# EAGLE schematic CHM‑T36VA (EAGLE 9.5.2)
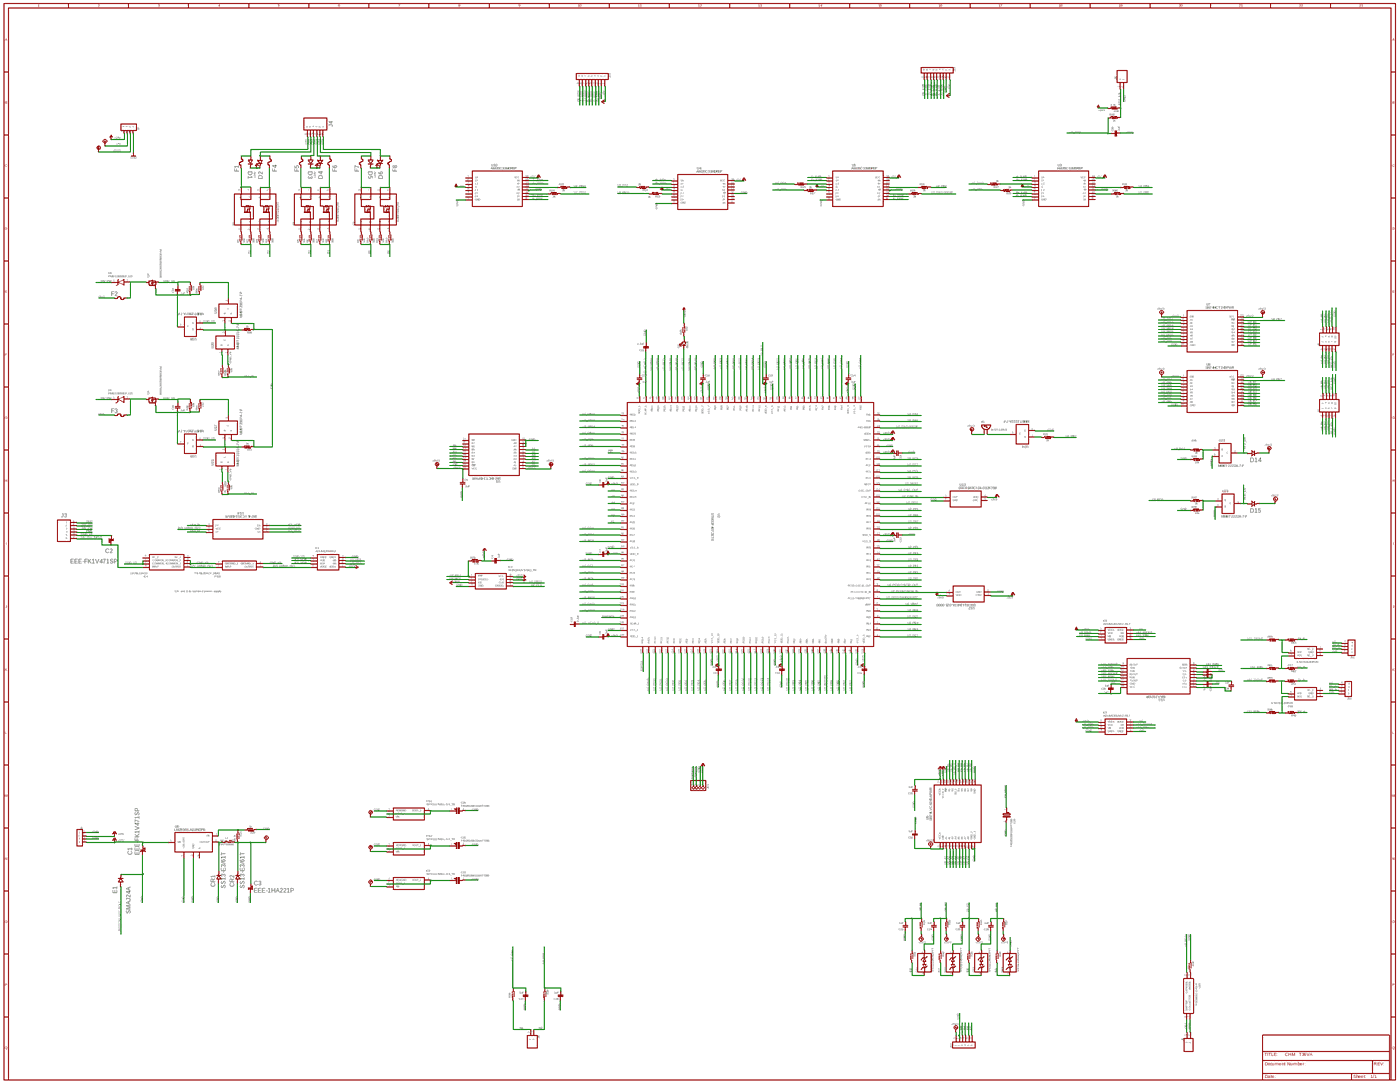
[diagram p0: schematic, sheet 1, overview]
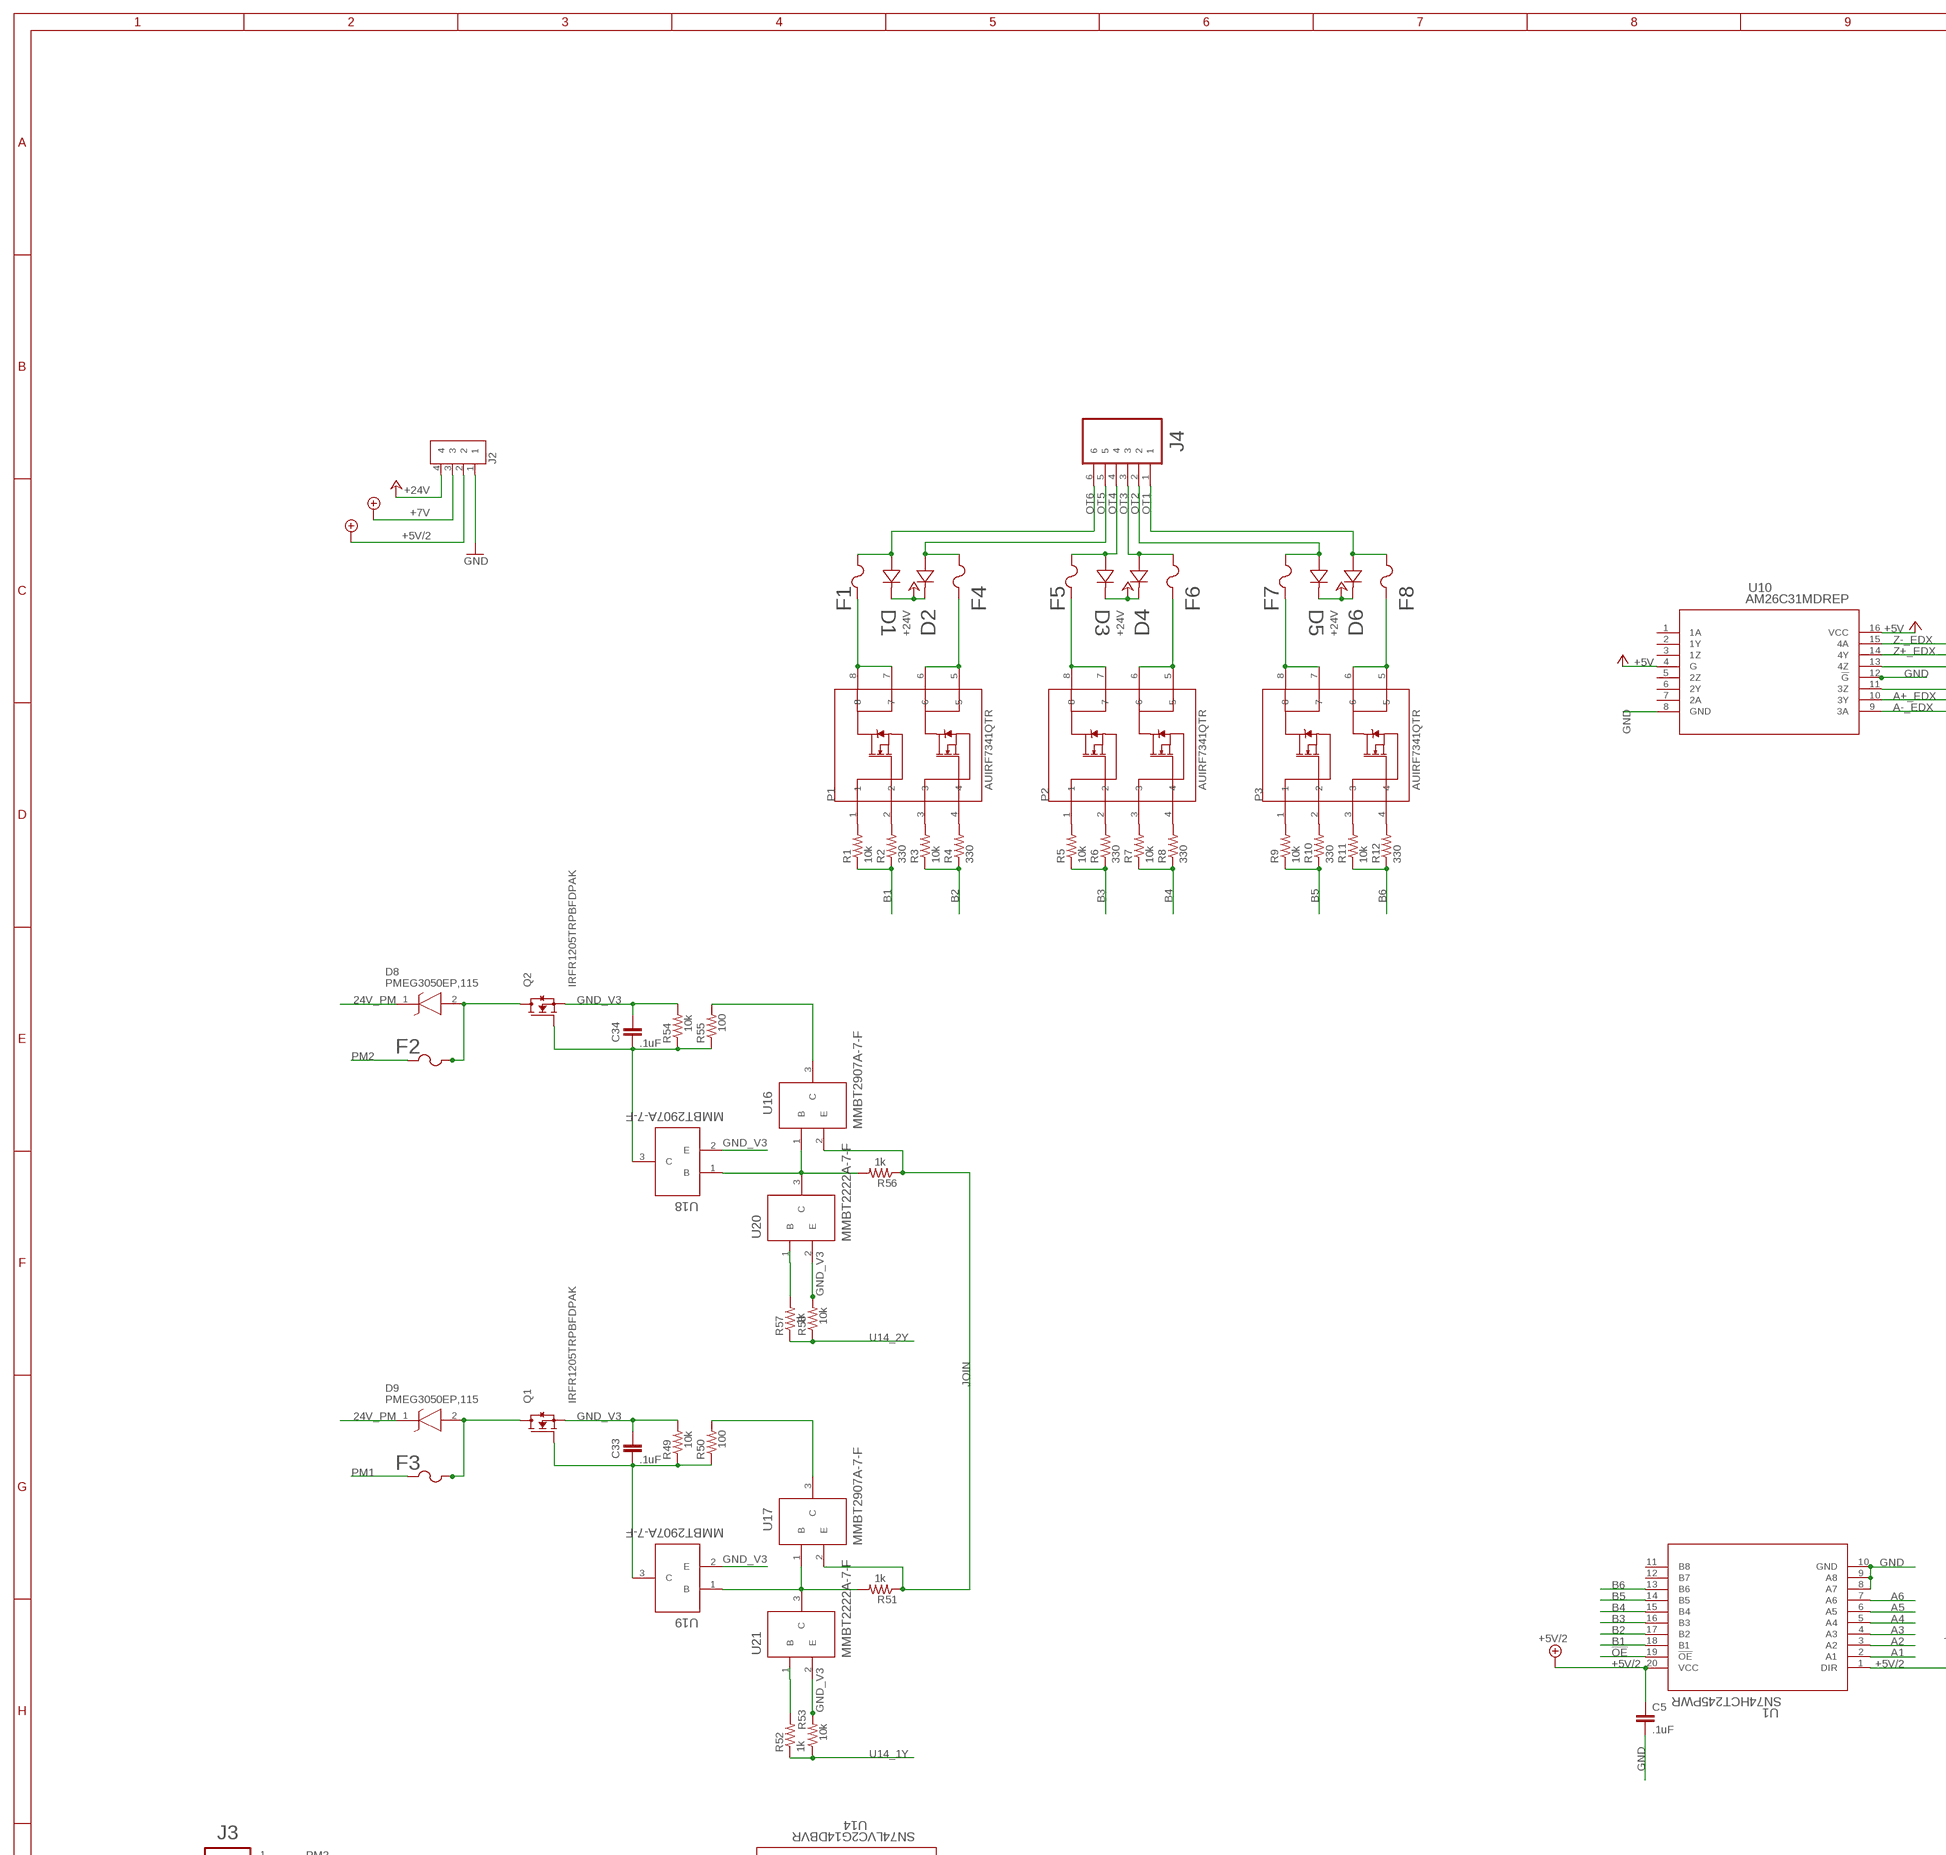
[diagram p1: schematic, sheet 1, part 1 of 6]
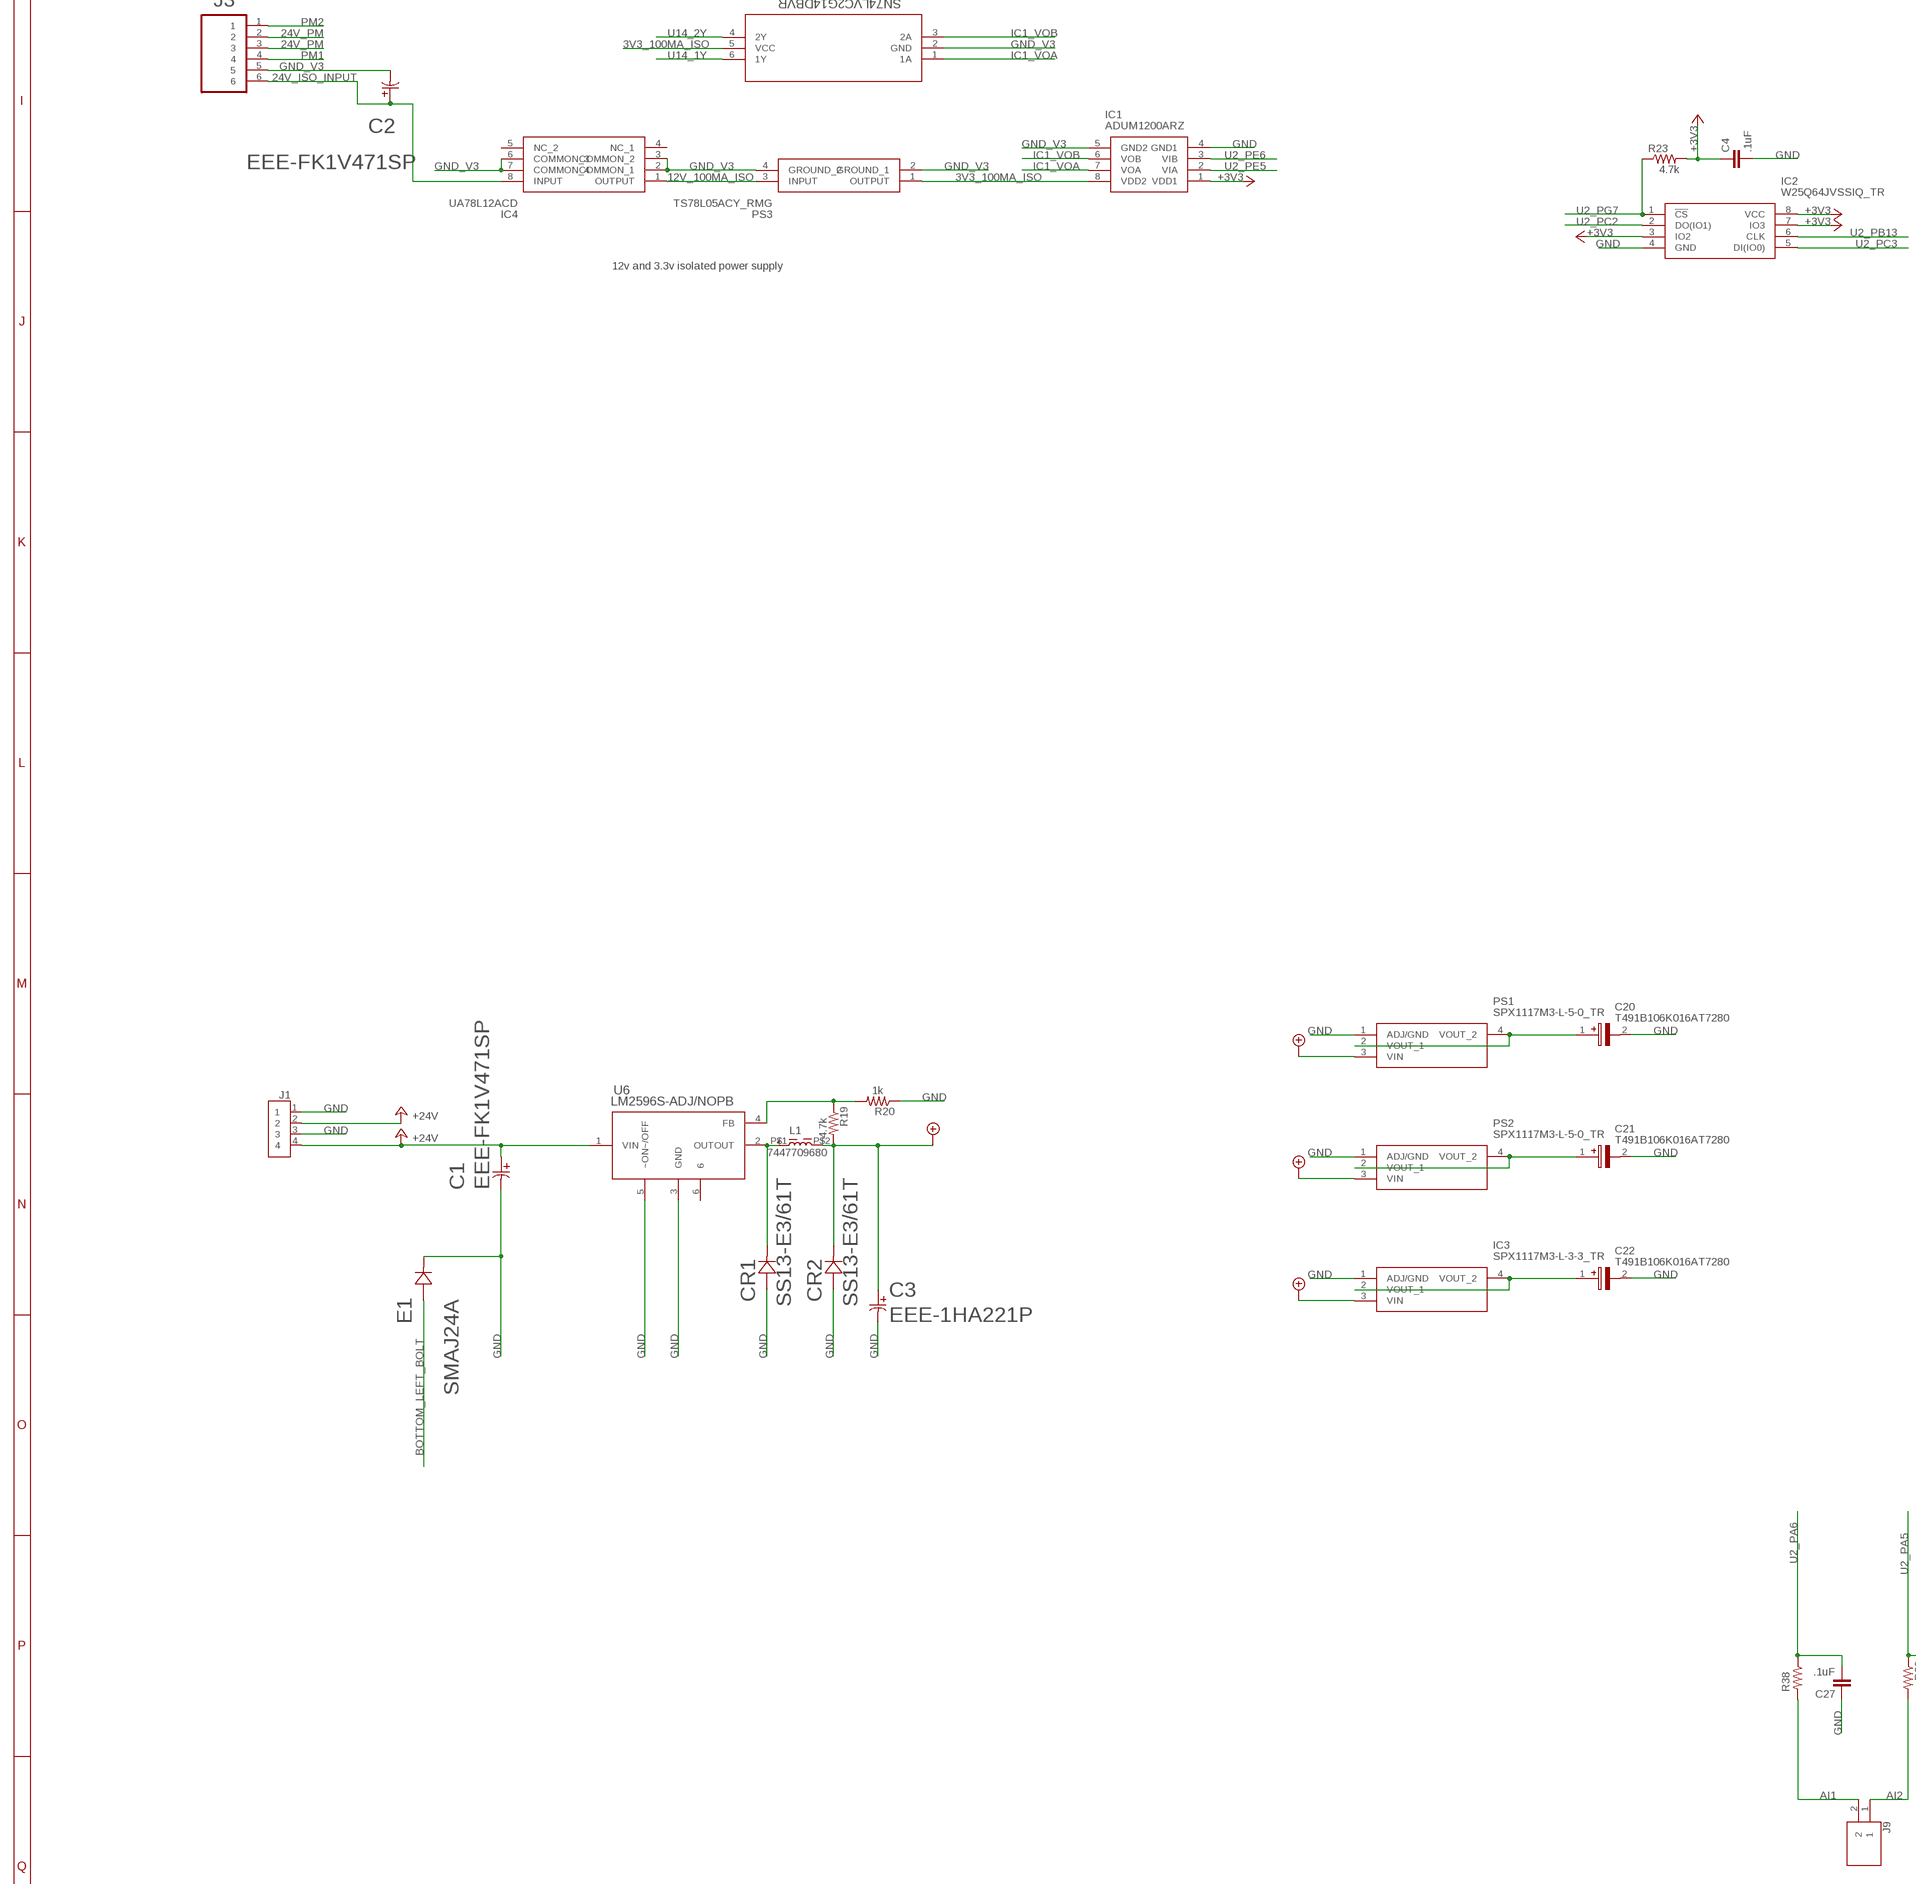
[diagram p2: schematic, sheet 1, part 2 of 6]
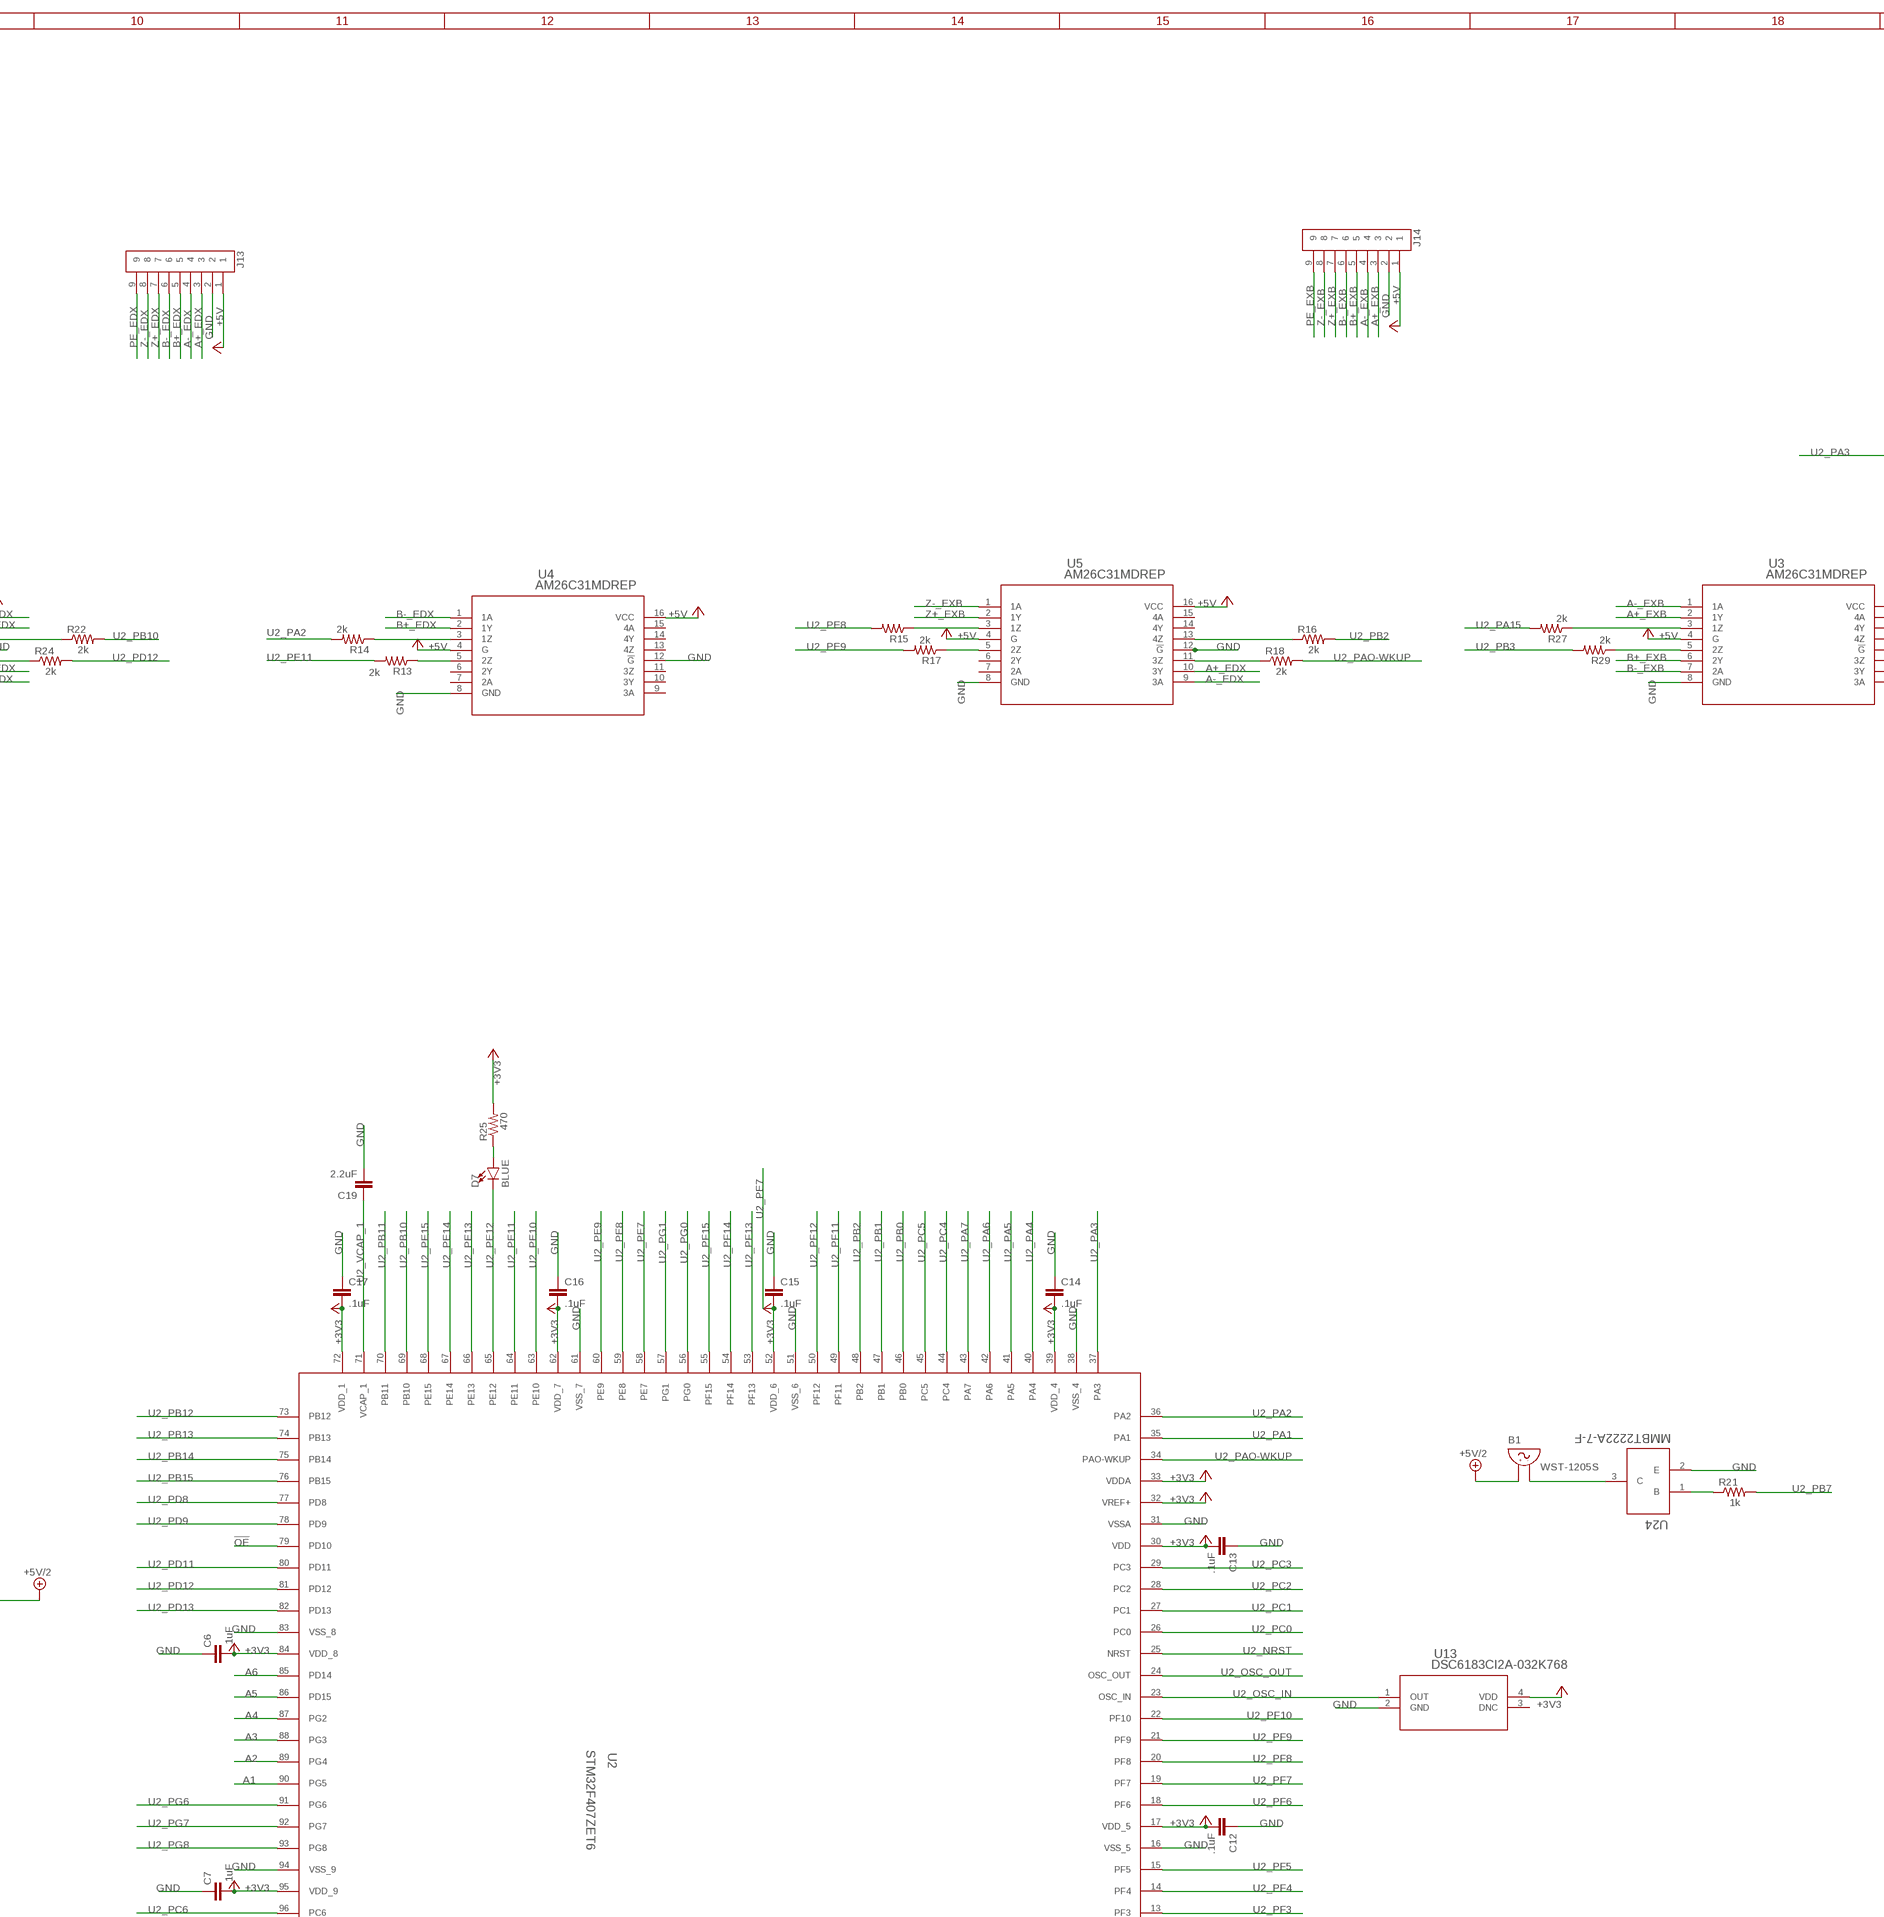
[diagram p3: schematic, sheet 1, part 3 of 6]
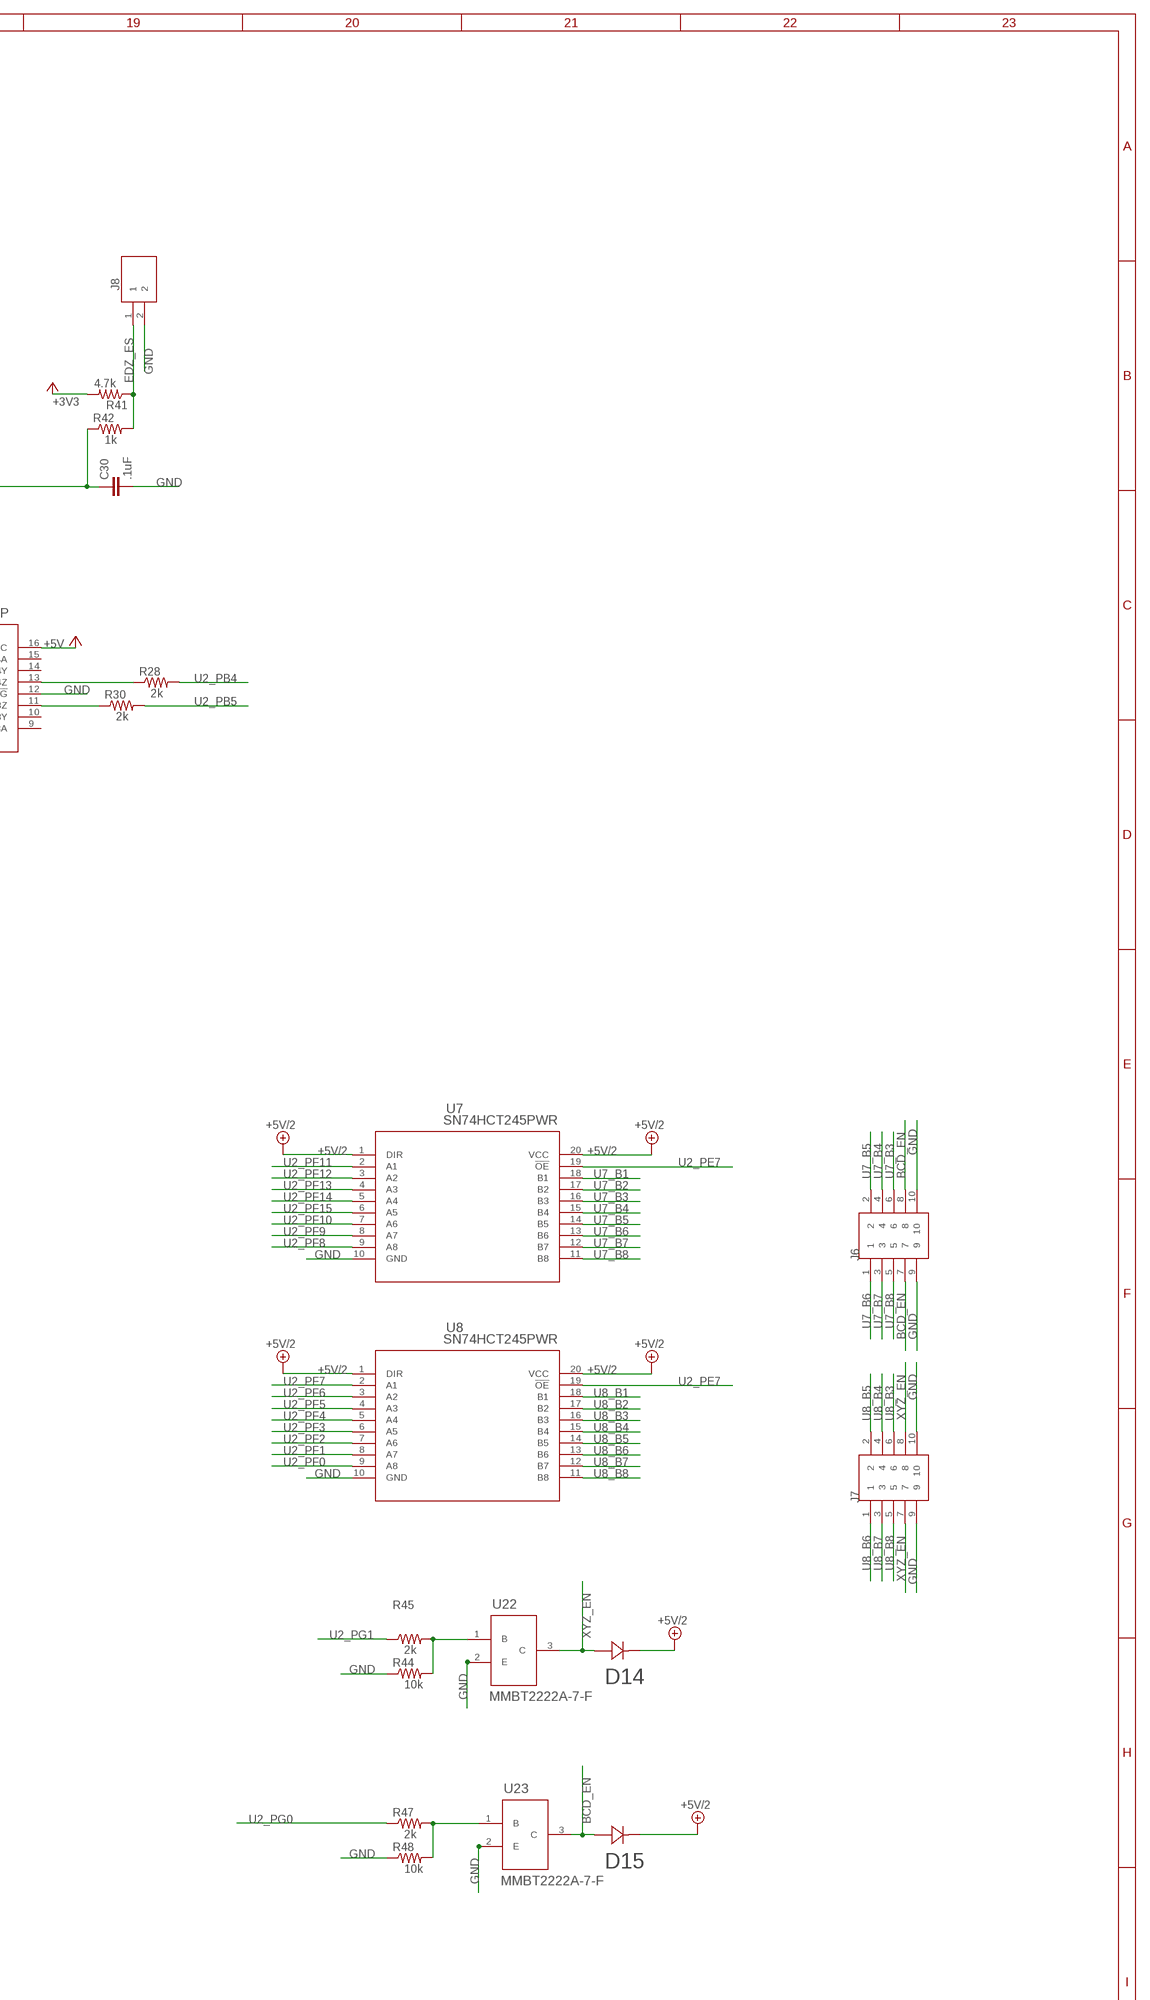
[diagram p4: schematic, sheet 1, part 4 of 6]
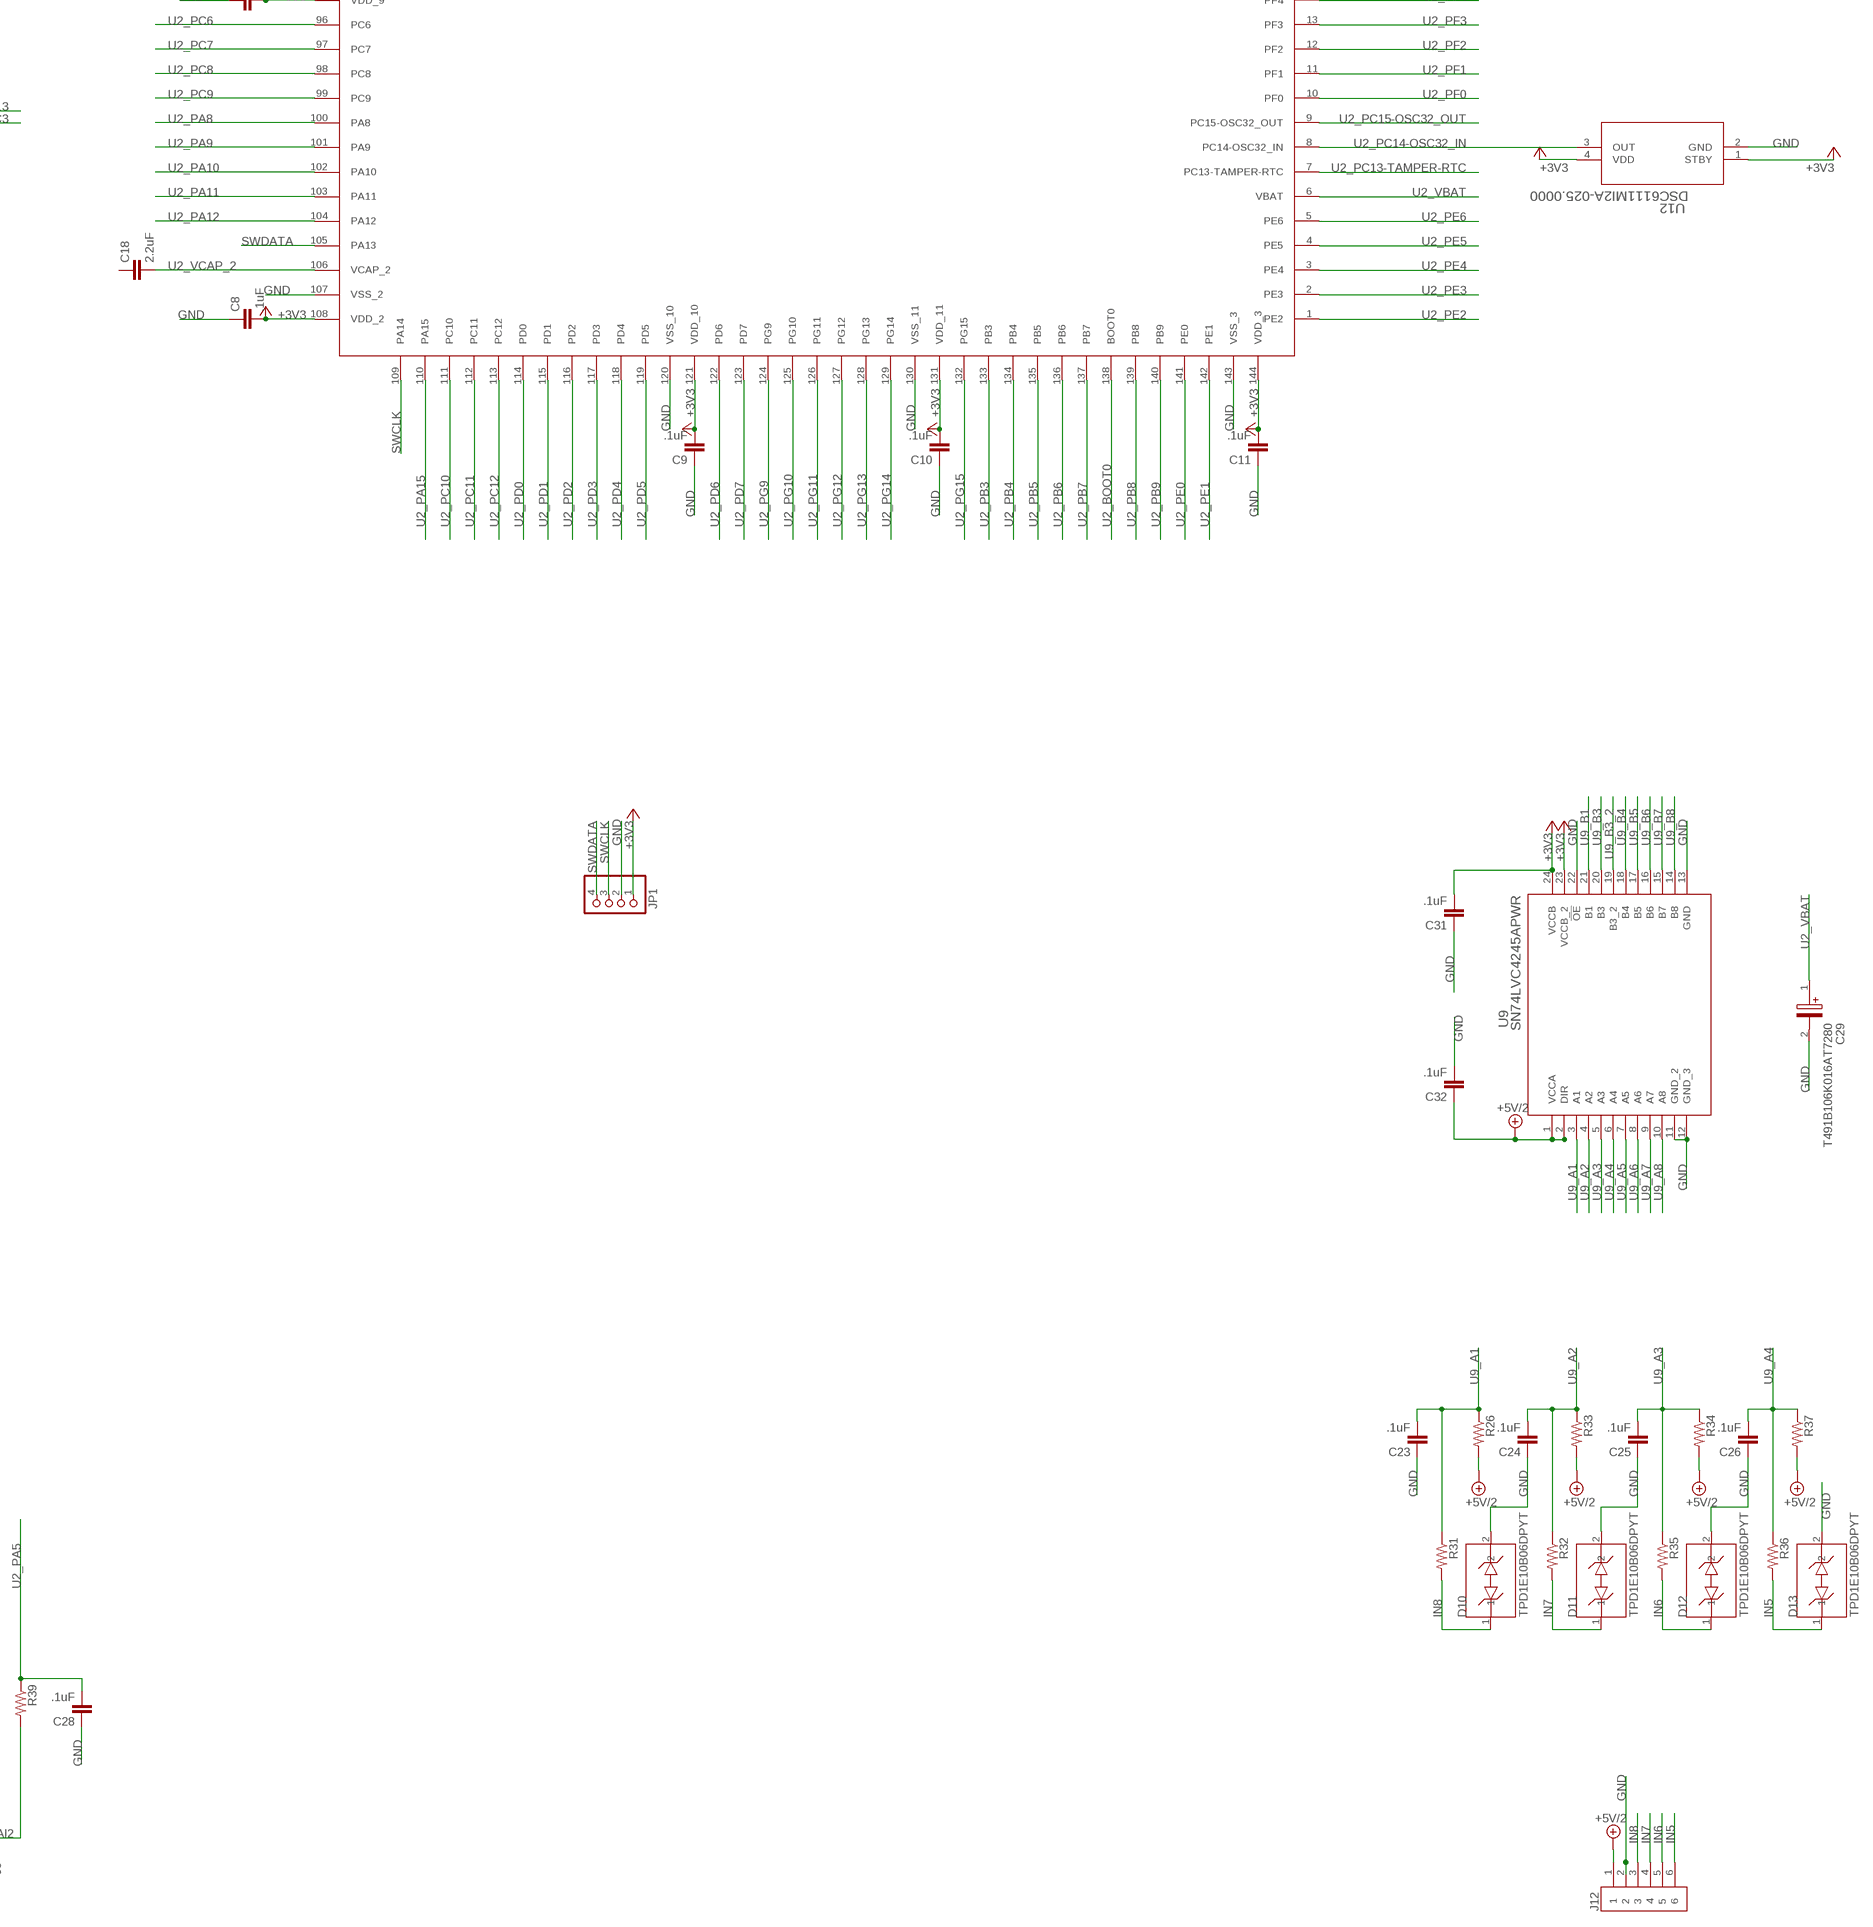
[diagram p5: schematic, sheet 1, part 5 of 6]
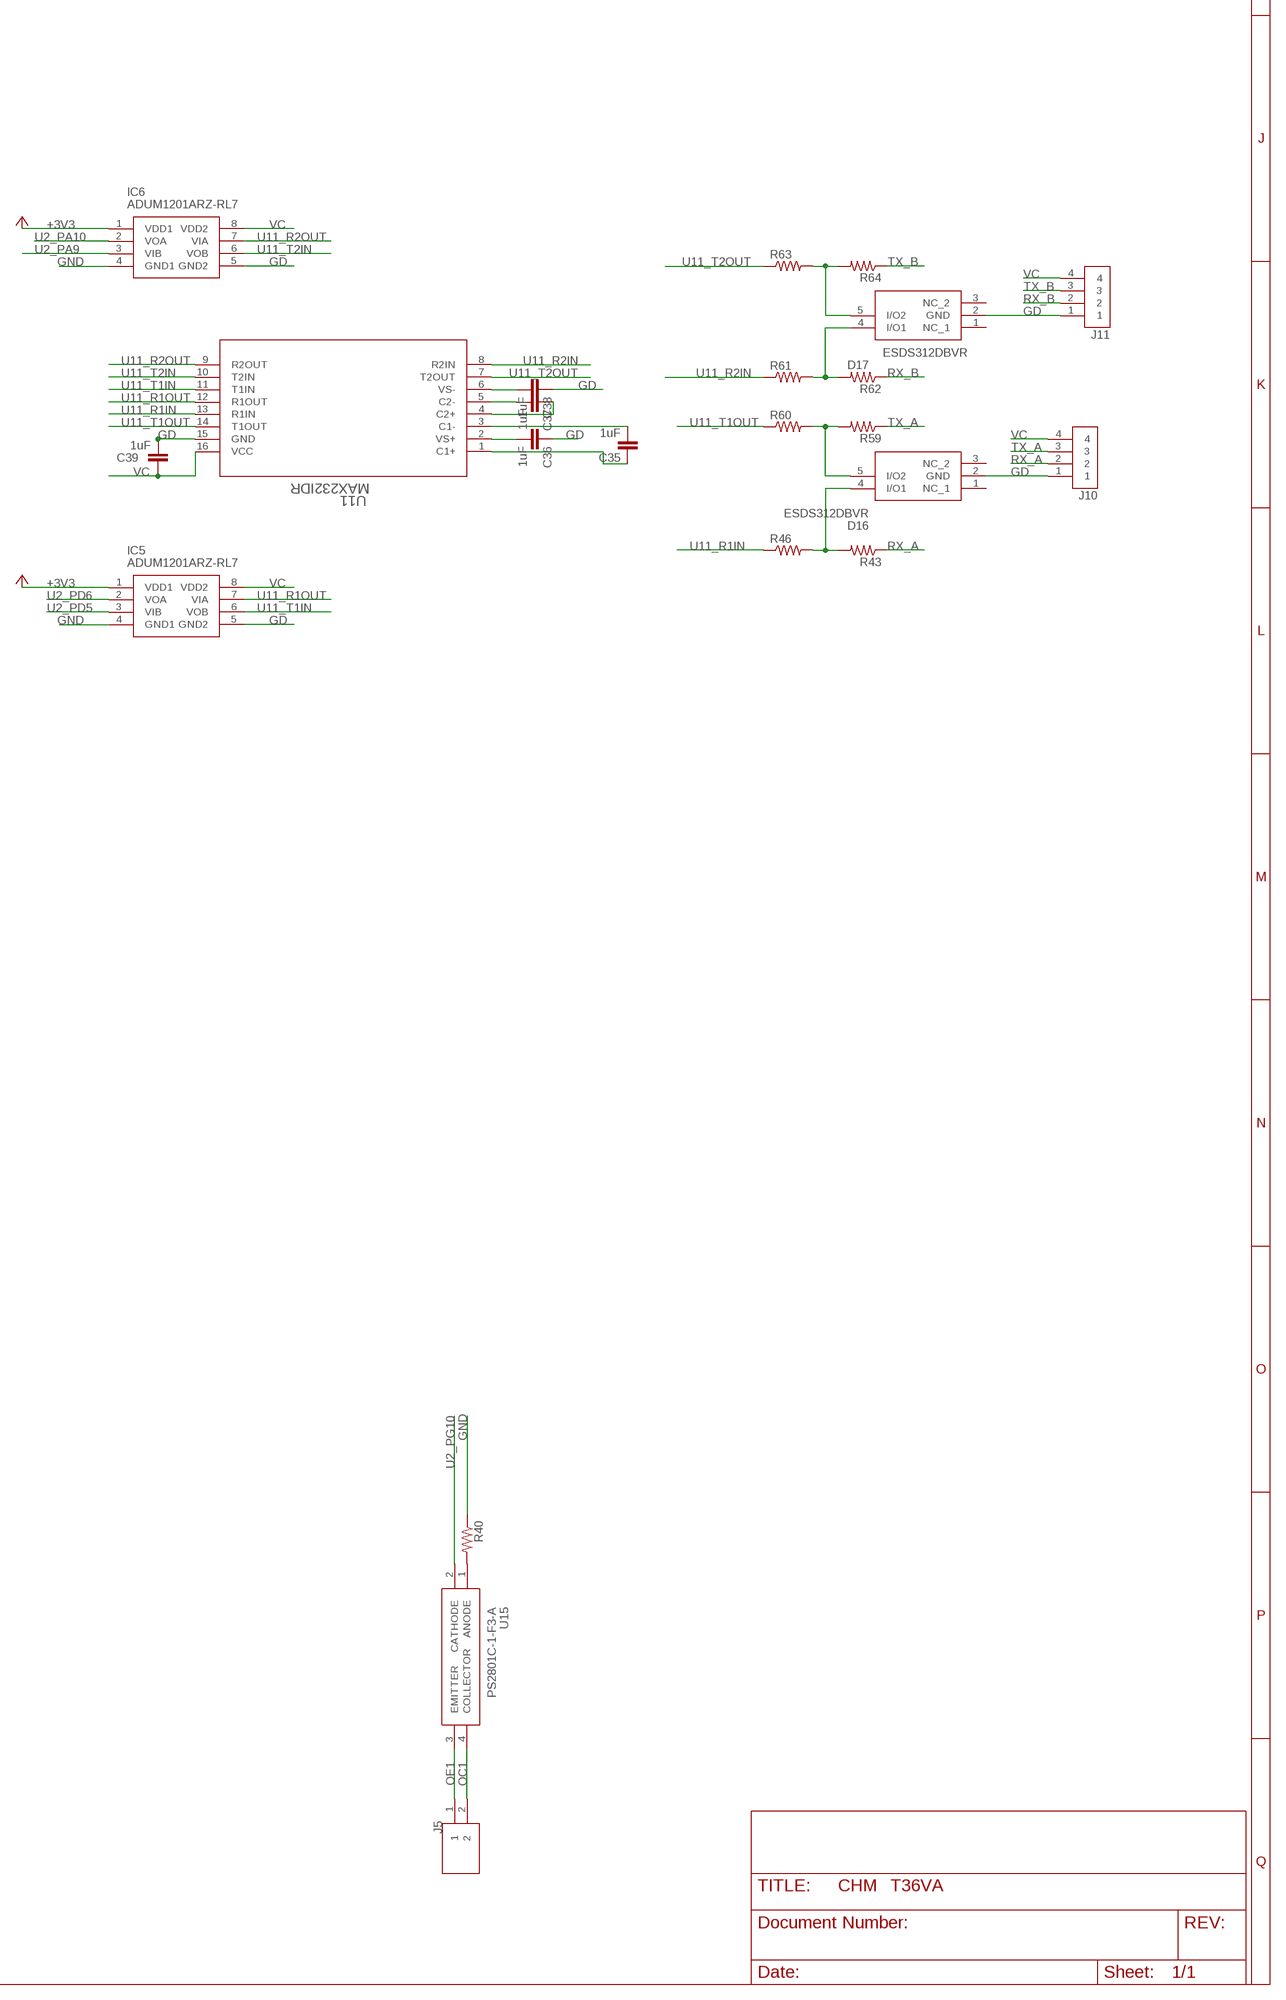
[diagram p6: schematic, sheet 1, part 6 of 6]

## Parts
B1  WST-1205S  [WST-1205S]
C1  EEE-FK1V471SP  [FKS-V_G]
C2  EEE-FK1V471SP  [FKS-V_G]
C3  EEE-1HA221P  [FKS-V_G]
C4  .1uF  C-EUC0603  [C0603]
C5  .1uF  C-EUC0603  [C0603]
C6  .1uF  C-EUC0603  [C0603]
C7  .1uF  C-EUC0603  [C0603]
C8  .1uF  C-EUC0603  [C0603]
C9  .1uF  C-EUC0603  [C0603]
C10  .1uF  C-EUC0603  [C0603]
C11  .1uF  C-EUC0603  [C0603]
C12  .1uF  C-EUC0603  [C0603]
C13  .1uF  C-EUC0603  [C0603]
C14  .1uF  C-EUC0603  [C0603]
C15  .1uF  C-EUC0603  [C0603]
C16  .1uF  C-EUC0603  [C0603]
C17  .1uF  C-EUC0603  [C0603]
C18  2.2uF  C-EUC0603  [C0603]
C19  2.2uF  C-EUC0603  [C0603]
C20  T491B106K016AT7280  [CAPPM3528X210N]
C21  T491B106K016AT7280  [CAPPM3528X210N]
C22  T491B106K016AT7280  [CAPPM3528X210N]
C23  .1uF  C-EUC0603  [C0603]
C24  .1uF  C-EUC0603  [C0603]
C25  .1uF  C-EUC0603  [C0603]
C26  .1uF  C-EUC0603  [C0603]
C27  .1uF  C-EUC0603  [C0603]
C28  .1uF  C-EUC0603  [C0603]
C29  T491B106K016AT7280  [CAPPM3528X210N]
C30  .1uF  C-EUC0603  [C0603]
C31  .1uF  C-EUC0603  [C0603]
C32  .1uF  C-EUC0603  [C0603]
C33  .1uF  C-EUC0603  [C0603]
C34  .1uF  C-EUC0603  [C0603]
C35  1uF  C-EUC0603  [C0603]
C36  1uF  C-EUC0603  [C0603]
C37  1uF  C-EUC0603  [C0603]
C38  1uF  C-EUC0603  [C0603]
C39  1uF  C-EUC0603  [C0603]
CR1  SS13-E3/61T  [DO-214AC]
CR2  SS13-E3/61T  [DO-214AC]
D1  SS14-E3/61T  [DO-214AC]
D2  SS14-E3/61T  [DO-214AC]
D3  SS14-E3/61T  [DO-214AC]
D4  SS14-E3/61T  [DO-214AC]
D5  SS14-E3/61T  [DO-214AC]
D6  SS14-E3/61T  [DO-214AC]
D7  BLUE  LED-BLUE0603  [LED-0603]
D8  PMEG3050EP,115  [PMEG3050EP115]
D9  PMEG3050EP,115  [PMEG3050EP115]
D10  TPD1E10B06DPYT  [DFN100X60X45-2N]
D11  TPD1E10B06DPYT  [DFN100X60X45-2N]
D12  TPD1E10B06DPYT  [DFN100X60X45-2N]
D13  TPD1E10B06DPYT  [DFN100X60X45-2N]
D14  SS14-E3/61T  [DO-214AC]
D15  SS14-E3/61T  [DO-214AC]
D16  ESDS312DBVR  [SOT95P280X145-5N]
D17  ESDS312DBVR  [SOT95P280X145-5N]
E1  SMAJ24A  [SMASERIES]
F1  RXEF110  [FUS_RXEF110_TYCO]
F2  RXEF110  [FUS_RXEF110_TYCO]
F3  RXEF110  [FUS_RXEF110_TYCO]
F4  RXEF110  [FUS_RXEF110_TYCO]
F5  RXEF110  [FUS_RXEF110_TYCO]
F6  RXEF110  [FUS_RXEF110_TYCO]
F7  RXEF110  [FUS_RXEF110_TYCO]
F8  RXEF110  [FUS_RXEF110_TYCO]
IC1  ADUM1200ARZ  [SOIC127P600X175-8N]
IC2  W25Q64JVSSIQ_TR  [SOIC127P790X216-8N]
IC3  SPX1117M3-L-3-3_TR  [SOT230P700X180-4N]
IC4  UA78L12ACD  [SOIC127P600X175-8N]
IC5  ADUM1201ARZ-RL7  [SOIC127P600X175-8N]
IC6  ADUM1201ARZ-RL7  [SOIC127P600X175-8N]
J1  1-1123723-4  [TE_1-1123723-4]
J2  1-1123723-4  [TE_1-1123723-4]
J3  1-1123723-6  [TE_1-1123723-6]
J4  1-1123723-6  [TE_1-1123723-6]
J5  1546551-2  [TE_1546551-2]
J6  5499923-1  [TE_5499923-1]
J7  5499923-1  [TE_5499923-1]
J8  B2B-XH-A(LF)(SN)  [JST_B2B-XH-A(LF)(SN)]
J9  B2B-XH-A(LF)(SN)  [JST_B2B-XH-A(LF)(SN)]
J10  B4B-XH-A(LF)(SN)  [JST_B4B-XH-A(LF)(SN)]
J11  B4B-XH-A(LF)(SN)  [JST_B4B-XH-A(LF)(SN)]
J12  B6B-XH-A(LF)(SN)  [JST_B6B-XH-A(LF)(SN)]
J13  B9B-XH-A(LF)(SN)  [JST_B9B-XH-A(LF)(SN)]
J14  B9B-XH-A(LF)(SN)  [JST_B9B-XH-A(LF)(SN)]
JP1  PINHD-1X4  [1X04]
L1  7447709680  [7447709101]
P1  AUIRF7341QTR  [SOIC127P600X168-9N]
P2  AUIRF7341QTR  [SOIC127P600X168-9N]
P3  AUIRF7341QTR  [SOIC127P600X168-9N]
PS1  SPX1117M3-L-5-0_TR  [SOT230P700X170-4N]
PS2  SPX1117M3-L-5-0_TR  [SOT230P700X170-4N]
PS3  TS78L05ACY_RMG  [TS78L05ACYRMG]
Q1  IRFR1205TRPBFDPAK  [DPAK228P998X240-3N]
Q2  IRFR1205TRPBFDPAK  [DPAK228P998X240-3N]
R1  10k  R-US_R0603  [R0603]
R2  330  R-US_R0603  [R0603]
R3  10k  R-US_R0603  [R0603]
R4  330  R-US_R0603  [R0603]
R5  10k  R-US_R0603  [R0603]
R6  330  R-US_R0603  [R0603]
R7  10k  R-US_R0603  [R0603]
R8  330  R-US_R0603  [R0603]
R9  10k  R-US_R0603  [R0603]
R10  330  R-US_R0603  [R0603]
R11  10k  R-US_R0603  [R0603]
R12  330  R-US_R0603  [R0603]
R13  2k  R-US_R0603  [R0603]
R14  2k  R-US_R0603  [R0603]
R15  2k  R-US_R0603  [R0603]
R16  2k  R-US_R0603  [R0603]
R17  2k  R-US_R0603  [R0603]
R18  2k  R-US_R0603  [R0603]
R19  4.7k  R-US_R0603  [R0603]
R20  1k  R-US_R0603  [R0603]
R21  1k  R-US_R0603  [R0603]
R22  2k  R-US_R0603  [R0603]
R23  4.7k  R-US_R0603  [R0603]
R24  2k  R-US_R0603  [R0603]
R25  470  R-US_R0603  [R0603]
R26  10k  R-US_R0603  [R0603]
R27  2k  R-US_R0603  [R0603]
R28  2k  R-US_R0603  [R0603]
R29  2k  R-US_R0603  [R0603]
R30  2k  R-US_R0603  [R0603]
R31  1k  R-US_R0603  [R0603]
R32  1k  R-US_R0603  [R0603]
R33  10k  R-US_R0603  [R0603]
R34  10k  R-US_R0603  [R0603]
R35  1k  R-US_R0603  [R0603]
R36  1k  R-US_R0603  [R0603]
R37  10k  R-US_R0603  [R0603]
R38  1k  R-US_R0603  [R0603]
R39  1k  R-US_R0603  [R0603]
R40  470  R-US_R0603  [R0603]
R41  4.7k  R-US_R0603  [R0603]
R42  1k  R-US_R0603  [R0603]
R43  330  R-US_R0603  [R0603]
R44  10k  R-US_R0603  [R0603]
R45  2k  R-US_R0603  [R0603]
R46  330  R-US_R0603  [R0603]
R47  2k  R-US_R0603  [R0603]
R48  10k  R-US_R0603  [R0603]
R49  10k  R-US_R0603  [R0603]
R50  100  R-US_R0603  [R0603]
R51  1k  R-US_R0603  [R0603]
R52  1k  R-US_R0603  [R0603]
R53  10k  R-US_R0603  [R0603]
R54  10k  R-US_R0603  [R0603]
R55  100  R-US_R0603  [R0603]
R56  1k  R-US_R0603  [R0603]
R57  1k  R-US_R0603  [R0603]
R58  10k  R-US_R0603  [R0603]
R59  330  R-US_R0603  [R0603]
R60  330  R-US_R0603  [R0603]
R61  330  R-US_R0603  [R0603]
R62  330  R-US_R0603  [R0603]
R63  330  R-US_R0603  [R0603]
R64  330  R-US_R0603  [R0603]
U1  SN74HCT245PWR  [PW20]
U2  STM32F407ZET6  [LQFP-144]
U3  AM26C31MDREP  [D16]
U4  AM26C31MDREP  [D16]
U5  AM26C31MDREP  [D16]
U6  LM2596S-ADJ/NOPB  [TS5B]
U7  SN74HCT245PWR  [PW20]
U8  SN74HCT245PWR  [PW20]
U9  SN74LVC4245APWR  [PW24]
U10  AM26C31MDREP  [D16]
U11  MAX232IDR  [D16]
U12  DSC6111MI2A-025.0000  [VFLGA4_2X1.6]
U13  DSC6183CI2A-032K768  [DFN4_3.2X2.5]
U14  SN74LVC2G14DBVR  [DBV6]
U15  PS2801C-1-F3-A  [SOIC127P700X210-4N]
U16  MMBT2907A-7-F  [SOT-23]
U17  MMBT2907A-7-F  [SOT-23]
U18  MMBT2907A-7-F  [SOT-23]
U19  MMBT2907A-7-F  [SOT-23]
U20  MMBT2222A-7-F  [SOT-23]
U21  MMBT2222A-7-F  [SOT-23]
U22  MMBT2222A-7-F  [SOT-23]
U23  MMBT2222A-7-F  [SOT-23]
U24  MMBT2222A-7-F  [SOT-23]

## Nets
3V3_100MA_ISO: IC1.8(VDD2) PS3.1(OUTPUT) U14.5(VCC)
12V_100MA_ISO: IC4.1(OUTPUT) PS3.3(INPUT)
24V_ISO_INPUT: C2.2 IC4.8(INPUT) J3.6
24V_PM: D8.1(K) D9.1(K) J3.2 J3.3
!OE: U1.19(!OE) U2.79(PD10)
+3V3: C4.1 C6.2 C7.2 C8.2 C9.2 C10.2 C11.2 C12.2 C13.2 C14.2 C15.2 C16.2 C17.2 C31.2 IC1.1(VDD1) IC2.3(IO2) IC2.7(IO3) IC2.8(VCC) IC5.1(VDD1) IC6.1(VDD1) JP1.1 R23.2 R25.2 R41.2 U2.17(VDD_5) U2.30(VDD) U2.32(VREF+) U2.33(VDDA) U2.39(VDD_4) U2.52(VDD_6) U2.62(VDD_7) U2.72(VDD_1) U2.84(VDD_8) U2.95(VDD_9) U2.108(VDD_2) U2.121(VDD_10) U2.131(VDD_11) U2.144(VDD_3) U9.23(VCCB_2) U9.24(VCCB) U12.1(STBY) U12.4(VDD) U13.4(VDD)
+5V: J13.1 J14.1 U3.4(G) U3.16(VCC) U4.4(G) U4.16(VCC) U5.4(G) U5.16(VCC) U10.4(G) U10.16(VCC)
+5V/2: B1.+ C5.1 C32.1 D14.1 D15.1 J2.2 J12.1 R26.2 R33.2 R34.2 R37.2 U1.1(DIR) U1.20(VCC) U7.1(DIR) U7.20(VCC) U8.1(DIR) U8.20(VCC) U9.1(VCCA) U9.2(DIR)
+7V: C3.2 CR2.1 IC3.3(VIN) J2.3 L1.P$2 PS1.3(VIN) PS2.3(VIN) R19.2
+24V: C1.2 D1.1 D2.1 D3.1 D4.1 D5.1 D6.1 J1.2 J1.4 J2.4 U6.1(VIN)
A1: U1.2(A1) U2.90(PG5)
A2: U1.3(A2) U2.89(PG4)
A3: U1.4(A3) U2.88(PG3)
A4: U1.5(A4) U2.87(PG2)
A5: U1.6(A5) U2.86(PD15)
A6: U1.7(A6) U2.85(PD14)
A+_EDX: J13.3 U5.10(3Y) U10.10(3Y)
A+_EXB: J14.3 U3.2(1Y)
A-_EDX: J13.4 U5.9(3A) U10.9(3A)
A-_EXB: J14.4 U3.1(1A)
AI1: J9.2 R38.2
AI2: J9.1 R39.2
B1: R1.1 R2.1 U1.18(B1)
B2: R3.1 R4.1 U1.17(B2)
B3: R5.1 R6.1 U1.16(B3)
B4: R7.1 R8.1 U1.15(B4)
B5: R9.1 R10.1 U1.14(B5)
B6: R11.1 R12.1 U1.13(B6)
B+_EDX: J13.5 U4.2(1Y)
B+_EXB: J14.5 U3.6(2Y)
B-_EDX: J13.6 U4.1(1A)
B-_EXB: J14.6 U3.7(2A)
BCD_EN: D15.2 J6.7 J6.8 U23.3(C)
BOTTOM_LEFT_BOLT: E1.2
EDZ_ES: J8.1 R41.1 R42.2
GD: C36.1 C38.1 C39.2 D16.2(GND) D17.2(GND) IC5.5(GND2) IC6.5(GND2) J10.1 J11.1 U11.15(GND)
GND: C1.1 C3.1 C4.2 C5.2 C6.1 C7.1 C8.1 C9.1 C10.1 C11.1 C12.1 C13.1 C14.1 C15.1 C16.1 C17.1 C19.2 C20.2(-) C21.2(-) C22.2(-) C23.1 C24.1 C25.1 C26.1 C27.1 C28.1 C29.2(-) C30.2 C31.1 C32.2 CR1.2 CR2.2 D10.2 D11.2 D12.2 D13.2 E1.1 IC1.4(GND1) IC2.4(GND) IC3.1(ADJ/GND) IC5.4(GND1) IC6.4(GND1) J1.1 J1.3 J2.1 J6.9 J6.10 J7.9 J7.10 J8.2 J12.2 J13.2 J14.2 JP1.2 PS1.1(ADJ/GND) PS2.1(ADJ/GND) R20.1 R40.1 R44.1 R48.1 U1.8(A7) U1.9(A8) U1.10(GND) U2.16(VSS_5) U2.31(VSSA) U2.38(VSS_4) U2.51(VSS_6) U2.61(VSS_7) U2.83(VSS_8) U2.94(VSS_9) U2.107(VSS_2) U2.120(VSS_10) U2.130(VSS_11) U2.143(VSS_3) U3.8(GND) U3.12(!G) U4.8(GND) U4.12(!G) U5.8(GND) U5.12(!G) U6.3(GND) U6.5(~ON~/OFF) U7.10(GND) U8.10(GND) U9.11(GND_2) U9.12(GND_3) U9.13(GND) U9.22(!OE) U10.8(GND) U10.12(!G) U12.2(GND) U13.2(GND) U22.2(E) U23.2(E) U24.2(E)
GND_V3: C2.1 C33.1 C34.1 IC1.5(GND2) IC4.2(COMMON_1) IC4.3(COMMON_2) IC4.6(COMMON_3) IC4.7(COMMON_4) J3.5 PS3.2(GROUND_1) PS3.4(GROUND_2) Q1.3(S) Q2.3(S) R49.2 R53.2 R54.2 R58.2 U14.2(GND) U18.2(E) U19.2(E) U20.2(E) U21.2(E)
IC1_VOA: IC1.7(VOA) U14.1(1A)
IC1_VOB: IC1.6(VOB) U14.3(2A)
IN5: D13.1 J12.6 R36.2
IN6: D12.1 J12.5 R35.2
IN7: D11.1 J12.4 R32.2
IN8: D10.1 J12.3 R31.2
JOIN: R51.1 R56.1 U16.2(E) U17.2(E)
N$1: F4.1 P1.5 P1.6
N$2: P1.1 R1.2
N$3: P1.2 R2.2
N$4: F1.1 P1.7 P1.8
N$5: F6.1 P2.5 P2.6
N$6: F5.1 P2.7 P2.8
N$7: R16.1 U5.13(4Z)
N$8: F7.1 P3.7 P3.8
N$9: F8.1 P3.5 P3.6
N$10: P1.3 R3.2
N$11: P1.4 R4.2
N$12: P2.1 R5.2
N$13: P2.2 R6.2
N$14: P2.3 R7.2
N$15: P2.4 R8.2
N$16: R15.1 U5.3(1Z)
N$17: P3.1 R9.2
N$18: P3.2 R10.2
N$19: P3.3 R11.2
N$20: P3.4 R12.2
N$21: R17.1 U5.5(2Z)
N$22: R18.1 U5.11(3Z)
N$23: R27.1 U3.3(1Z)
N$24: R28.1 U3.13(4Z)
N$25: R29.1 U3.5(2Z)
N$26: R30.1 U3.11(3Z)
N$27: R13.1 U4.5(2Z)
N$28: R14.1 U4.3(1Z)
N$29: R19.1 R20.2 U6.4(FB)
N$30: D16.4(I/O1) R43.2 R46.2
N$31: D16.5(I/O2) R59.2 R60.2
N$32: CR1.1 L1.P$1 U6.2(OUTOUT)
N$33: R21.1 U24.1(B)
N$34: R22.1 U10.13(4Z)
N$35: B1.- U24.3(C)
N$36: R24.1 U10.11(3Z)
N$37: D7.A R25.1
N$38: C20.1(+) PS1.2(VOUT_1) PS1.4(VOUT_2)
N$39: C21.1(+) PS2.2(VOUT_1) PS2.4(VOUT_2)
N$40: C22.1(+) IC3.2(VOUT_1) IC3.4(VOUT_2)
N$41: D9.2(A) F3.2 Q1.2(D)
N$42: D8.2(A) F2.2 Q2.2(D)
N$43: R40.2 U15.1(ANODE)
N$44: D17.4(I/O1) R61.2 R62.2
N$45: R51.2 U17.1(B) U19.1(B) U21.3(C)
N$46: R44.2 R45.2 U22.1(B)
N$47: R56.2 U16.1(B) U18.1(B) U20.3(C)
N$48: R47.2 R48.2 U23.1(B)
N$49: R52.2 U21.1(B)
N$50: C33.2 Q1.1(G) R49.1 R50.1 U19.3(C)
N$51: R50.2 U17.3(C)
N$52: R57.2 U20.1(B)
N$53: C34.2 Q2.1(G) R54.1 R55.1 U18.3(C)
N$54: R55.2 U16.3(C)
N$55: D17.5(I/O2) R63.2 R64.2
N$56: C36.2 U11.2(VS+)
N$57: C35.2 U11.3(C1-)
N$58: C37.2 U11.5(C2-)
N$59: C37.1 U11.4(C2+)
N$60: C38.2 U11.6(VS-)
N$61: C35.1 U11.1(C1+)
OC1: J5.2 U15.4(COLLECTOR)
OE1: J5.1 U15.3(EMITTER)
OT1: D6.2 F8.2 J4.1
OT2: D5.2 F7.2 J4.2
OT3: D4.2 F6.2 J4.3
OT4: D3.2 F5.2 J4.4
OT5: D2.2 F4.2 J4.5
OT6: D1.2 F1.2 J4.6
PE_EDX: J13.9
PE_EXB: J14.9
PM1: F3.1 J3.4
PM2: F2.1 J3.1
RX_A: J10.2 R43.1
RX_B: J11.2 R62.1
SWCLK: JP1.3 U2.109(PA14)
SWDATA: JP1.4 U2.105(PA13)
TX_A: J10.3 R59.1
TX_B: J11.3 R64.1
U2_BOOT0: U2.138(BOOT0)
U2_NRST: U2.25(NRST)
U2_OSC_IN: U2.23(OSC_IN) U13.1(OUT)
U2_OSC_OUT: U2.24(OSC_OUT)
U2_PA1: U2.35(PA1)
U2_PA2: R14.2 U2.36(PA2)
U2_PA3: C30.1 R42.1 U2.37(PA3)
U2_PA4: U2.40(PA4)
U2_PA5: C28.2 R39.1 U2.41(PA5)
U2_PA6: C27.2 R38.1 U2.42(PA6)
U2_PA7: U2.43(PA7)
U2_PA8: U2.100(PA8)
U2_PA9: IC6.3(VIB) U2.101(PA9)
U2_PA10: IC6.2(VOA) U2.102(PA10)
U2_PA11: U2.103(PA11)
U2_PA12: U2.104(PA12)
U2_PA15: R27.2 U2.110(PA15)
U2_PAO-WKUP: R18.2 U2.34(PAO-WKUP)
U2_PB0: U2.46(PB0)
U2_PB1: U2.47(PB1)
U2_PB2: R16.2 U2.48(PB2)
U2_PB3: R29.2 U2.133(PB3)
U2_PB4: R28.2 U2.134(PB4)
U2_PB5: R30.2 U2.135(PB5)
U2_PB6: U2.136(PB6)
U2_PB7: R21.2 U2.137(PB7)
U2_PB8: U2.139(PB8)
U2_PB9: U2.140(PB9)
U2_PB10: R22.2 U2.69(PB10)
U2_PB11: U2.70(PB11)
U2_PB12: U2.73(PB12)
U2_PB13: IC2.6(CLK) U2.74(PB13)
U2_PB14: U2.75(PB14)
U2_PB15: U2.76(PB15)
U2_PC0: U2.26(PC0)
U2_PC1: U2.27(PC1)
U2_PC2: IC2.2(DO(IO1)) U2.28(PC2)
U2_PC3: IC2.5(DI(IO0)) U2.29(PC3)
U2_PC4: U2.44(PC4)
U2_PC5: U2.45(PC5)
U2_PC6: U2.96(PC6)
U2_PC7: U2.97(PC7)
U2_PC8: U2.98(PC8)
U2_PC9: U2.99(PC9)
U2_PC10: U2.111(PC10)
U2_PC11: U2.112(PC11)
U2_PC12: U2.113(PC12)
U2_PC13-TAMPER-RTC: U2.7(PC13-TAMPER-RTC)
U2_PC14-OSC32_IN: U2.8(PC14-OSC32_IN) U12.3(OUT)
U2_PC15-OSC32_OUT: U2.9(PC15-OSC32_OUT)
U2_PD0: U2.114(PD0)
U2_PD1: U2.115(PD1)
U2_PD2: U2.116(PD2)
U2_PD3: U2.117(PD3)
U2_PD4: U2.118(PD4)
U2_PD5: IC5.3(VIB) U2.119(PD5)
U2_PD6: IC5.2(VOA) U2.122(PD6)
U2_PD7: U2.123(PD7)
U2_PD8: U2.77(PD8)
U2_PD9: U2.78(PD9)
U2_PD11: U2.80(PD11)
U2_PD12: R24.2 U2.81(PD12)
U2_PD13: U2.82(PD13)
U2_PE0: U2.141(PE0)
U2_PE1: U2.142(PE1)
U2_PE2: U2.1(PE2)
U2_PE3: U2.2(PE3)
U2_PE4: U2.3(PE4)
U2_PE5: IC1.2(VIA) U2.4(PE5)
U2_PE6: IC1.3(VIB) U2.5(PE6)
U2_PE7: U2.58(PE7) U7.19(!OE) U8.19(!OE)
U2_PE8: R15.2 U2.59(PE8)
U2_PE9: R17.2 U2.60(PE9)
U2_PE10: U2.63(PE10)
U2_PE11: R13.2 U2.64(PE11)
U2_PE12: D7.C U2.65(PE12)
U2_PE13: U2.66(PE13)
U2_PE14: U2.67(PE14)
U2_PE15: U2.68(PE15)
U2_PF0: U2.10(PF0) U8.9(A8)
U2_PF1: U2.11(PF1) U8.8(A7)
U2_PF2: U2.12(PF2) U8.7(A6)
U2_PF3: U2.13(PF3) U8.6(A5)
U2_PF4: U2.14(PF4) U8.5(A4)
U2_PF5: U2.15(PF5) U8.4(A3)
U2_PF6: U2.18(PF6) U8.3(A2)
U2_PF7: U2.19(PF7) U8.2(A1)
U2_PF8: U2.20(PF8) U7.9(A8)
U2_PF9: U2.21(PF9) U7.8(A7)
U2_PF10: U2.22(PF10) U7.7(A6)
U2_PF11: U2.49(PF11) U7.2(A1)
U2_PF12: U2.50(PF12) U7.3(A2)
U2_PF13: U2.53(PF13) U7.4(A3)
U2_PF14: U2.54(PF14) U7.5(A4)
U2_PF15: U2.55(PF15) U7.6(A5)
U2_PG0: R47.1 U2.56(PG0)
U2_PG1: R45.1 U2.57(PG1)
U2_PG6: U2.91(PG6)
U2_PG7: IC2.1(!CS) R23.1 U2.92(PG7)
U2_PG8: U2.93(PG8)
U2_PG9: U2.124(PG9)
U2_PG10: U2.125(PG10) U15.2(CATHODE)
U2_PG11: U2.126(PG11)
U2_PG12: U2.127(PG12)
U2_PG13: U2.128(PG13)
U2_PG14: U2.129(PG14)
U2_PG15: U2.132(PG15)
U2_VBAT: C29.1(+) U2.6(VBAT)
U2_VCAP_1: C19.1 U2.71(VCAP_1)
U2_VCAP_2: C18.2 U2.106(VCAP_2)
U7_B1: U7.18(B1)
U7_B2: U7.17(B2)
U7_B3: J6.6 U7.16(B3)
U7_B4: J6.4 U7.15(B4)
U7_B5: J6.2 U7.14(B5)
U7_B6: J6.1 U7.13(B6)
U7_B7: J6.3 U7.12(B7)
U7_B8: J6.5 U7.11(B8)
U8_B1: U8.18(B1)
U8_B2: U8.17(B2)
U8_B3: J7.6 U8.16(B3)
U8_B4: J7.4 U8.15(B4)
U8_B5: J7.2 U8.14(B5)
U8_B6: J7.1 U8.13(B6)
U8_B7: J7.3 U8.12(B7)
U8_B8: J7.5 U8.11(B8)
U9_A1: C23.2 R26.1 R31.1 U9.3(A1)
U9_A2: C24.2 R32.1 R33.1 U9.4(A2)
U9_A3: C25.2 R34.1 R35.1 U9.5(A3)
U9_A4: C26.2 R36.1 R37.1 U9.6(A4)
U9_A5: U9.7(A5)
U9_A6: U9.8(A6)
U9_A7: U9.9(A7)
U9_A8: U9.10(A8)
U9_B1: U9.21(B1)
U9_B3: U9.20(B3)
U9_B3_2: U9.19(B3_2)
U9_B4: U9.18(B4)
U9_B5: U9.17(B5)
U9_B6: U9.16(B6)
U9_B7: U9.15(B7)
U9_B8: U9.14(B8)
U11_R1IN: R46.1 U11.13(R1IN)
U11_R1OUT: IC5.7(VIA) U11.12(R1OUT)
U11_R2IN: R61.1 U11.8(R2IN)
U11_R2OUT: IC6.7(VIA) U11.9(R2OUT)
U11_T1IN: IC5.6(VOB) U11.11(T1IN)
U11_T1OUT: R60.1 U11.14(T1OUT)
U11_T2IN: IC6.6(VOB) U11.10(T2IN)
U11_T2OUT: R63.1 U11.7(T2OUT)
U14_1Y: R52.1 R53.1 U14.6(1Y)
U14_2Y: R57.1 R58.1 U14.4(2Y)
VC: C39.1 IC5.8(VDD2) IC6.8(VDD2) J10.4 J11.4 U11.16(VCC)
XYZ_EN: D14.2 J7.7 J7.8 U22.3(C)
Z+_EDX: J13.7 U10.14(4Y)
Z+_EXB: J14.7 U5.2(1Y)
Z-_EDX: J13.8 U10.15(4A)
Z-_EXB: J14.8 U5.1(1A)
Unconnected: C18.1 D16.1(NC_1) D16.3(NC_2) D17.1(NC_1) D17.3(NC_2) IC4.4(NC_1) IC4.5(NC_2) U1.11(B8) U1.12(B7) U3.9(3A) U3.10(3Y) U3.14(4Y) U3.15(4A) U4.6(2Y) U4.7(2A) U4.9(3A) U4.10(3Y) U4.11(3Z) U4.13(4Z) U4.14(4Y) U4.15(4A) U5.6(2Y) U5.7(2A) U5.14(4Y) U5.15(4A) U6.6 U10.1(1A) U10.2(1Y) U10.3(1Z) U10.5(2Z) U10.6(2Y) U10.7(2A) U13.3(DNC)

## Notes on the sheet
- 12v and 3.3v isolated power supply

## Library data of the parts
B1 = BUZZERS:WST-1205S: BUZZER 2.3KHZ 4-6VDC; DESCRIPTION: Buzzers Indicator, Internally Driven Magnetic 5V 40mA 2.3kHz 85dB @ 5V, 10cm Through Hole PC Pins; DIGI-KEY_PART_NUMBER: 433-1029-ND; DIGI-KEY_PURCHASE_URL: https://www.digikey.com/product-detail/en/soberton-inc/WST-1205S/433-1029-ND/479675?utm_source=snapeda&utm_medium=aggregator&utm_campaign=symbol; MF: Soberton Inc.; MP: WST-1205S; PACKAGE: Soberton Inc.
C1 C2 = Custom Capacitors:EEE-FK1V471SP
C3 = Custom Capacitors:EEE-1HA221P
C4-C19 C23-C28 C30-C39 = rcl:C-EU: CAPACITOR, European symbol; SPICEPREFIX: C
C20-C22 C29 = TANTALUM CAPACITOR's:T491B106K016AT7280: Tantalum Capacitors - Solid SMD 16V 10uF 1311 10% ESR=2ohms Source: Datasheet <https://api.kemet.com/component-edge/download/datasheet/T491B106K016AT7280.pdf>; DESCRIPTION: Tantalum Capacitors - Solid SMD 16V 10uF 1311 10% ESR=2ohms; HEIGHT: 2.1mm; MANUFACTURER_NAME: Kemet; MANUFACTURER_PART_NUMBER: T491B106K016AT7280; MOUSER_PART_NUMBER: 80-T491B106K16AT7280; MOUSER_PRICE-STOCK: https://www.mouser.com/Search/Refine.aspx?Keyword=80-T491B106K16AT7280
CR1 CR2 = Diodes:SS13-E3/61T; BUILT_BY: EMA_UL_Team; MANUFACTURER_PART_NUMBER: SS14-E3/61T; VENDOR: VISHAY
D1-D6 D14 D15 = Diodes:SS14-E3/61T; BUILT_BY: EMA_UL_Team; MANUFACTURER_PART_NUMBER: SS14-E3/61T; VENDOR: VISHAY
D7 = LED:LED-BLUE: Blue SMD LED Used in manufacturing of various products at SparkFun Packages: 0603 - SMD 0603 package [Product Link] <http://www.digikey.com/product-detail/en/SMLE12BC7TT86/511-1589-2-ND/1641808> 1206 - SMD1206 package [Product Link] <http://www.digikey.com/product-detail/en/lite-on-inc/LTST-C150TBKT/160-1643-1-ND/573584> SparkFun Products: ESP8266 Thing-Dev Board <https://www.sparkfun.com/products/13711> RedBoard <https://www.sparkfun.com/products/12757>; PROD_ID: DIO-08575
D8 D9 = Diodes:PMEG3050EP,115: NXP PMEG3050EP,115 SMT Schottky Diode, 30V 5A, 2-Pin SOD-128 Source: Datasheet <https://docs-emea.rs-online.com/webdocs/14cd/0900766b814cd012.pdf>; DESCRIPTION: NXP PMEG3050EP,115 SMT Schottky Diode, 30V 5A, 2-Pin SOD-128; HEIGHT: 1mm; MANUFACTURER_NAME: Nexperia; MANUFACTURER_PART_NUMBER: PMEG3050EP,115; MOUSER_PART_NUMBER: 771-PMEG3050EP115; MOUSER_PRICE-STOCK: https://www.mouser.com/Search/Refine.aspx?Keyword=771-PMEG3050EP115; RS_PART_NUMBER: 7805398P; RS_PRICE-STOCK: http://uk.rs-online.com/web/p/products/7805398P
D10-D13 = Diodes:TPD1E10B06DPYT: Single Channel ESD in 0402 package with 10pF Capacitance and 6V Breakdown 2-X1SON -40 to 125; DESCRIPTION: 14V Clamp 5A _8/20µs_ Ipp Tvs Diode Surface Mount 2-X1SON _1x.60_; DIGI-KEY_PART_NUMBER: 296-41842-1-ND; DIGI-KEY_PURCHASE_URL: https://www.digikey.com/product-detail/en/texas-instruments/TPD1E10B06DPYT/296-41842-1-ND/5224472?utm_source=snapeda&utm_medium=aggregator&utm_campaign=symbol; MF: Texas Instruments; MP: TPD1E10B06DPYT; PACKAGE: XDFN-2 Texas Instruments
D16 D17 = Diodes:ESDS312DBVR: 3.6V Data-Line Surge and 30kV ESD Protection Diode Array Source: Datasheet <http://www.ti.com/lit/gpn/esds312>; DESCRIPTION: 3.6V Data-Line Surge and 30kV ESD Protection Diode Array; HEIGHT: 1.45mm; MANUFACTURER_NAME: Texas Instruments; MANUFACTURER_PART_NUMBER: ESDS312DBVR; MOUSER_PART_NUMBER: 595-ESDS312DBVR; MOUSER_PRICE-STOCK: https://www.mouser.com/Search/Refine.aspx?Keyword=595-ESDS312DBVR
E1 = Diodes:SMAJ24A; BUILT_BY: EMA_UL_Team; MANUFACTURER_PART_NUMBER: SMAJ24A; VENDOR: Littelfuse Inc
F1-F8 = Fuses:RXEF110; BUILT_BY: EMA_UL_Team; MANUFACTURER_PART_NUMBER: RXEF110; VENDOR: TE Connectivity
IC1 = DIGITAL_ISOLATORS:ADUM1200ARZ: Analog Devices ADUM1200ARZ PCB SMT 2-channel Digital Isolator, 2500 V, 8-Pin SOIC Source: Datasheet <https://componentsearchengine.com/Datasheets/1/ADUM1200ARZ.pdf>; DESCRIPTION: Analog Devices ADUM1200ARZ PCB SMT 2-channel Digital Isolator, 2500 V, 8-Pin SOIC; HEIGHT: 1.75mm; MANUFACTURER_NAME: Analog Devices; MANUFACTURER_PART_NUMBER: ADUM1200ARZ; MOUSER_PART_NUMBER: 584-ADUM1200ARZ; MOUSER_PRICE-STOCK: https://www.mouser.com/Search/Refine.aspx?Keyword=584-ADUM1200ARZ
IC2 = FLASH:W25Q64JVSSIQ_TR: NOR Flash spiFlash, 64M-bit, DTR, 4Kb Uniform Sector Source: Datasheet <https://componentsearchengine.com/Datasheets/1/W25Q64JVSSIQ TR.pdf>; DESCRIPTION: NOR Flash spiFlash, 64M-bit, DTR, 4Kb Uniform Sector; HEIGHT: 2.16mm; MANUFACTURER_NAME: Winbond; MANUFACTURER_PART_NUMBER: W25Q64JVSSIQ TR; MOUSER_PART_NUMBER: 454-W25Q64JVSSIQTR; MOUSER_PRICE-STOCK: https://www.mouser.com/Search/Refine.aspx?Keyword=454-W25Q64JVSSIQTR
IC3 = DCtoDC:SPX1117M3-L-3-3_TR: LDO Voltage Regulators 800mALOW DROPOUT Source: Datasheet <https://componentsearchengine.com/Datasheets/1/SPX1117M3-L-3-3_TR.pdf>; ALLIED_NUMBER: 70413235; ALLIED_PRICE-STOCK: https://www.alliedelec.com/exar-spx1117m3-l-3-3-tr/70413235/; DESCRIPTION: LDO Voltage Regulators 800mALOW DROPOUT; HEIGHT: 1.8mm; MANUFACTURER_NAME: MaxLinear; MANUFACTURER_PART_NUMBER: SPX1117M3-L-3-3/TR; MOUSER_PART_NUMBER: 701-SPX1117M3-L-33TR; MOUSER_PRICE-STOCK: https://www.mouser.com/Search/Refine.aspx?Keyword=701-SPX1117M3-L-33TR
IC4 = DCtoDC:UA78L12ACD: 100-mA, 30-V VIN, Positive-Voltage Linear Regulators Source: Datasheet <http://www.ti.com/lit/ds/symlink/ua78l12a.pdf>; DESCRIPTION: 100-mA, 30-V VIN, Positive-Voltage Linear Regulators; HEIGHT: 1.75mm; MANUFACTURER_NAME: Texas Instruments; MANUFACTURER_PART_NUMBER: UA78L12ACD; MOUSER_PART_NUMBER: 595-UA78L12ACD; MOUSER_PRICE-STOCK: https://www.mouser.com/Search/Refine.aspx?Keyword=595-UA78L12ACD; RS_PART_NUMBER: 6616727P; RS_PRICE-STOCK: http://uk.rs-online.com/web/p/products/6616727P
IC5 IC6 = DIGITAL_ISOLATORS:ADUM1201ARZ-RL7: Digital Isolators Digital Dual-CH Source: Datasheet <http://www.analog.com/media/en/technical-documentation/data-sheets/ADuM1200_1201.pdf>; DESCRIPTION: Digital Isolators Digital Dual-CH; HEIGHT: 1.75mm; MANUFACTURER_NAME: Analog Devices; MANUFACTURER_PART_NUMBER: ADUM1201ARZ-RL7; MOUSER_PART_NUMBER: 584-ADUM1201ARZ-R7; MOUSER_PRICE-STOCK: https://www.mouser.com/Search/Refine.aspx?Keyword=584-ADUM1201ARZ-R7; RS_PART_NUMBER: 1832299; RS_PRICE-STOCK: http://uk.rs-online.com/web/p/products/1832299
J1 J2 = CONNECTOR_RECTANGULAR:1-1123723-4: Conn Wire to Board HDR 4 POS 3.96mm Solder ST Thru-Hole Automotive Bag; MANUFACTURER: TE Connectivity; PARTREV: AA3; STANDARD: Manufacturer Recommendations
J3 J4 = CONNECTOR_RECTANGULAR:1-1123723-6: CONN HEADER .156 VERT 6POS TIN; MANUFACTURER: TE CONNECTIVITY; PARTREV: AA3; STANDARD: MANUFACTURER RECOMMENDATIONS
J5 = CONNECTOR_RECTANGULAR:1546551-2; COMMENT: 1546551-2; DESCRIPTION: 2P,STRAIGHT,SIDE ENTRY,3.5MM; DIGI-KEY_PART_NUMBER: A112368-ND; DIGI-KEY_PURCHASE_URL: https://www.digikey.com/product-detail/en/te-connectivity-amp-connectors/1546551-2/A112368-ND/2221614?utm_source=snapeda&utm_medium=aggregator&utm_campaign=symbol; EU_ROHS_COMPLIANCE: Compliant with Exemptions; MF: TE Connectivity; MP: 1546551-2; PACKAGE: None; TE_PURCHASE_URL: https://www.te.com/usa-en/product-1546551-2.html?te_bu=Cor&te_type=disp&te_campaign=seda_glo_cor-seda-global-disp-prtnr-fy19-seda-model-bom-cta_sma-317_1&elqCampaignId=32493
J6 J7 = CONNECTOR_RECTANGULAR:5499923-1: A/L UNIV HDR 20P VERT LG LAT; COMMENT: 5499923-1; DESCRIPTION: Conn Ejector Header HDR 10 POS 2.54mm Solder ST Thru-Hole Tray; DIGI-KEY_PART_NUMBER: AHL10H-ND; DIGI-KEY_PURCHASE_URL: https://www.digikey.com/product-detail/en/te-connectivity-amp-connectors/5499923-1/AHL10H-ND/765694?utm_source=snapeda&utm_medium=aggregator&utm_campaign=symbol; EU_ROHS_COMPLIANCE: Compliant; MF: TE Connectivity; MP: 5499923-1; PACKAGE: None; TE_PURCHASE_URL: https://www.te.com/usa-en/product-5499923-1.html?te_bu=Cor&te_type=disp&te_campaign=seda_glo_cor-seda-global-disp-prtnr-fy19-seda-model-bom-cta_sma-317_1&elqCampaignId=32493
J8 J9 = CONNECTOR_RECTANGULAR:B2B-XH-A(LF)(SN): XH Series 2 Position 2.5 mm Pitch Through Hole Top Entry Shrouded Header; DESCRIPTION: Connector Header Through Hole 2 position 0.098 _2.50mm_; DIGI-KEY_PART_NUMBER: 455-2247-ND; DIGI-KEY_PURCHASE_URL: https://www.digikey.com/product-detail/en/jst-sales-america-inc/B2B-XH-A_LF__SN_/455-2247-ND/1651045?utm_source=snapeda&utm_medium=aggregator&utm_campaign=symbol; MF: JST Sales; MP: B2B-XH-A_LF__SN_; PACKAGE: None
J10 J11 = CONNECTOR_RECTANGULAR:B4B-XH-A(LF)(SN): XH Series 4 Position 2.5 mm Pitch Through Hole Crimp Top Entry Shrouded Header; DESCRIPTION: Connector Header Through Hole 4 position 0.098 _2.50mm_; DIGI-KEY_PART_NUMBER: 455-2249-ND; DIGI-KEY_PURCHASE_URL: https://www.digikey.com/product-detail/en/jst-sales-america-inc/B4B-XH-A_LF__SN_/455-2249-ND/1651047?utm_source=snapeda&utm_medium=aggregator&utm_campaign=symbol; MF: JST Sales; MP: B4B-XH-A_LF__SN_; PACKAGE: None
J12 = CONNECTOR_RECTANGULAR:B6B-XH-A(LF)(SN): XH Series 4 Position 2.5 mm Pitch Through Hole Crimp Top Entry Shrouded Header
J13 J14 = CONNECTOR_RECTANGULAR:B9B-XH-A(LF)(SN): XH Series 4 Position 2.5 mm Pitch Through Hole Crimp Top Entry Shrouded Header
JP1 = pinhead:PINHD-1X4: PIN HEADER
L1 = INDUCTOR's:7447709680
P1-P3 = MOSFET's:AUIRF7341QTR
PS1 PS2 = DCtoDC:SPX1117M3-L-5-0_TR: LDO Voltage Regulators 800mALOW DROPOUT Source: Datasheet <https://www.exar.com/ds/spx1117_ds_r210_082411.pdf>; DESCRIPTION: LDO Voltage Regulators 800mALOW DROPOUT; HEIGHT: 1.7mm; MANUFACTURER_NAME: EXAR; MANUFACTURER_PART_NUMBER: SPX1117M3-L-5-0/TR; MOUSER_PART_NUMBER: 701-SPX1117M3-L-50TR; MOUSER_PRICE-STOCK: https://www.mouser.com/Search/Refine.aspx?Keyword=701-SPX1117M3-L-50TR
PS3 = DCtoDC:TS78L05ACY_RMG: Taiwan Semiconductor, 5 V Linear Voltage Regulator, 150mA, 1-Channel, +/-4% 4-Pin, SOT-89 TS78L05ACY RMG Source: Datasheet <https://www.mouser.com/datasheet/2/395/TS78L00_J1801-1480058.pdf>; DESCRIPTION: Taiwan Semiconductor, 5 V Linear Voltage Regulator, 150mA, 1-Channel, +/-4% 4-Pin, SOT-89 TS78L05ACY RMG; HEIGHT: 1.6mm; MANUFACTURER_NAME: Taiwan Semiconductor; MANUFACTURER_PART_NUMBER: TS78L05ACY RMG; MOUSER_PART_NUMBER: 821-TS78L05ACYRMG; MOUSER_PRICE-STOCK: https://www.mouser.com/Search/Refine.aspx?Keyword=821-TS78L05ACYRMG; RS_PART_NUMBER: 0398524P; RS_PRICE-STOCK: http://uk.rs-online.com/web/p/products/0398524P
Q1 Q2 = MOSFET's:IRFR1205TRPBF: IRF7759 Series 75 V 2.3 mOhm 3.3 W N-Channel Power Mosfet - DirectFET ISOMETRIC
R1-R64 = rcl:R-US_: RESISTOR, American symbol; SPICEPREFIX: R
U1 U7 U8 = BUS TRANCEIVER's:SN74HCT245PWR; BUILT_BY: EMA_UL_Team; MANUFACTURER: Texas Instruments; MANUFACTURER_PART_NUMBER: SN74HCT245PWR; VENDOR: Texas Instruments
U2 = MICROCONTROLLER's:STM32F407ZET6; BUILT_BY: EMA_UL_Team; MANUFACTURER_PART_NUMBER: STM32F407ZET6; VENDOR: STMicroelectronics
U3-U5 U10 = BUS TRANCEIVER's:AM26C31MDREP; BUILT_BY: EMA_UL_Team; MANUFACTURER_PART_NUMBER: AM26C31MDREP; VENDOR: Texas Instruments
U6 = DCtoDC:LM2596S-ADJ/NOPB; BUILT_BY: EMA_UL_Team; MANUFACTURER_PART_NUMBER: LM2596S-ADJ/NOPB; VENDOR: Texas Instruments
U9 = BUS TRANCEIVER's:SN74LVC4245APWR; BUILT_BY: EMA_UL_Team; MANUFACTURER: Texas Instruments; MANUFACTURER_PART_NUMBER: SN74LVC4245APWR; VENDOR: Texas Instruments
U11 = BUS TRANCEIVER's:MAX232IDR; BUILT_BY: EMA_UL_Team; COPYRIGHT: Copyright (C) 2018 Accelerated Designs. All rights reserved; MANUFACTURER_PART_NUMBER: MAX232IDR; VENDOR: Texas Instruments
U12 = MEMS_OSCILLATORS:DSC6111MI2A-025.0000; BUILT_BY: EMA_April; COPYRIGHT: Copyright (C) 2018 Accelerated Designs. All rights reserved; MANUFACTURER_PART_NUMBER: DSC6111MI2A-025.0000; VENDOR: Microchip
U13 = MEMS_OSCILLATORS:DSC6183CI2A-032K768; BUILT_BY: EMA_April; COPYRIGHT: Copyright (C) 2018 Accelerated Designs. All rights reserved; MANUFACTURER_PART_NUMBER: DSC6183CI2A-032K768; VENDOR: Microchip
U14 = SCHMITT_TRIGGER's:SN74LVC2G14DBVR; BUILT_BY: EMA_UL_Team; MANUFACTURER: Texas Instruments; MANUFACTURER_PART_NUMBER: SN74LVC2G14DBVR; VENDOR: Texas Instruments
U15 = OPTOCOUPLER's:PS2801C-1-F3-A: NEC - PS2801C-1-F3-A - OPTOCOUPLER, TR O/P, SSOP-4 Source: Datasheet <http://www.farnell.com/datasheets/89583.pdf>; DESCRIPTION: NEC - PS2801C-1-F3-A - OPTOCOUPLER, TR O/P, SSOP-4; HEIGHT: 2.1mm; MANUFACTURER_NAME: NEC; MANUFACTURER_PART_NUMBER: PS2801C-1-F3-A
U16-U19 = TRANSISTORS:MMBT2907A-7-F: PNP 60V 600ma; BUILT_BY: EMA_UL_Team; MANUFACTURER_PART_NUMBER: MMBT2907A-7-F; VENDOR: Diodes Inc
U20-U24 = TRANSISTORS:MMBT2222A-7-F: NPN 40v 600ma; BUILT_BY: EMA_UL_Team; MANUFACTURER_PART_NUMBER: MMBT2222A-7-F; VENDOR: Diodes Inc